# EAGLE design CoPro09 (EAGLE 7.7.0)

## Sheet 1 of 6: LOGIC
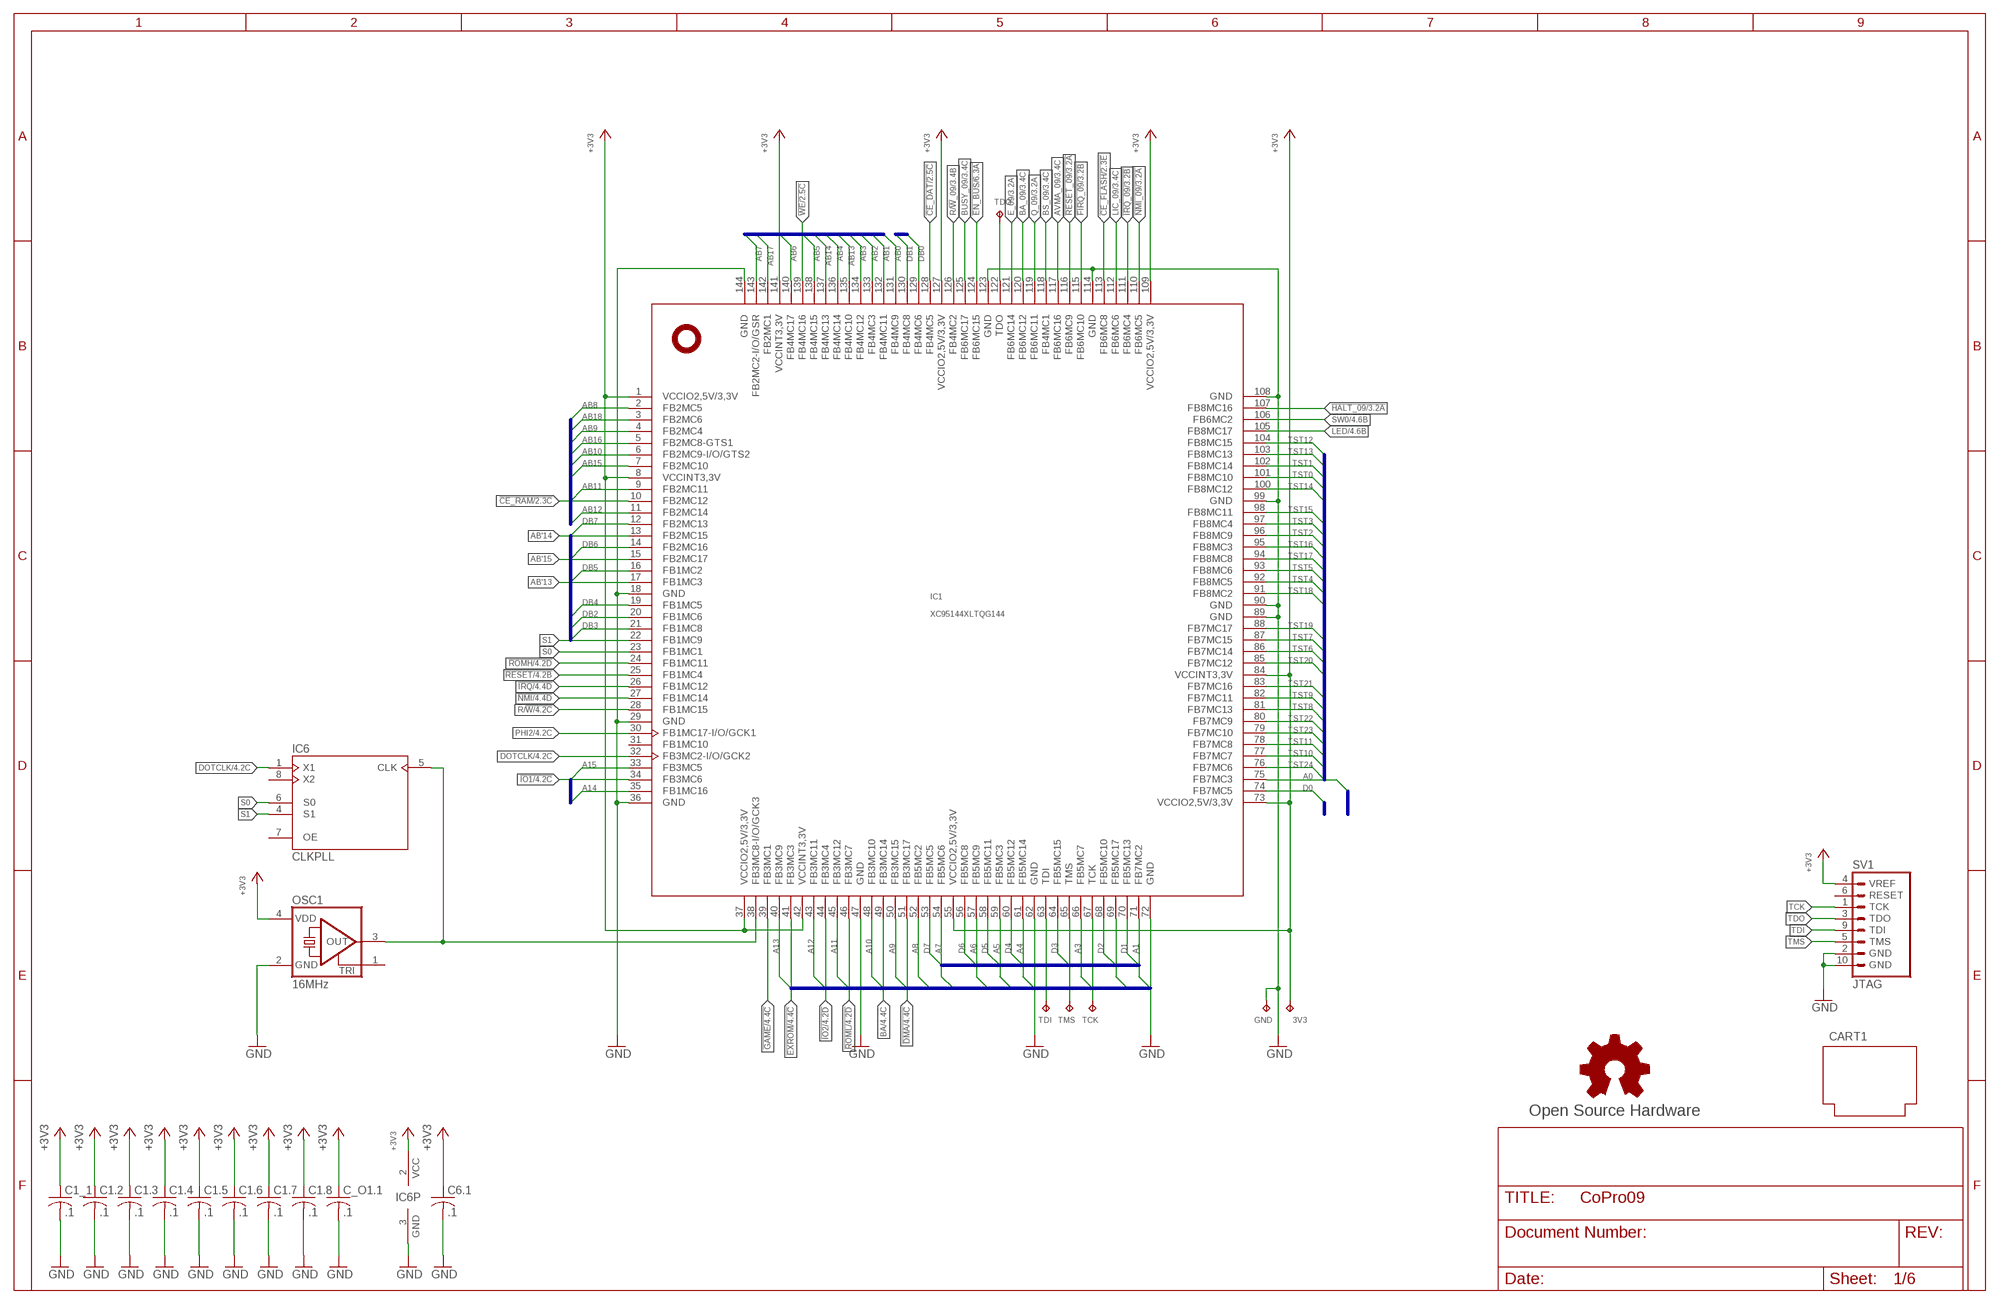
[diagram p0: schematic, sheet 1]

### Parts
3V3  TPTP08R  [TP08R]
C1.2  .1  C-USC0402  [C0402]
C1.3  .1  C-USC0402  [C0402]
C1.4  .1  C-USC0402  [C0402]
C1.5  .1  C-USC0402  [C0402]
C1.6  .1  C-USC0402  [C0402]
C1.7  .1  C-USC0402  [C0402]
C1.8  .1  C-USC0402  [C0402]
C1_1  .1  C-USC0402  [C0402]
C6.1  .1  C-USC0402  [C0402]
C_O1.1  .1  C-USC0402  [C0402]
CART1  CARTRIDGE_C64  [CARTRIDGE_C64]
GND  TPTP08R  [TP08R]
GOLD_ORB_SM1  Open Source Hardware  OSHWLOGOLOGO8MM  [OSHW_8MM]
IC1  XC95144XLTQG144  [TQFP144]
IC6  CLKPLL  [SOIC8]
OSC1  16MHz  ASE  [ASE]
SV1  JTAG  [JTAG]
TCK  TPTP08R  [TP08R]
TDI  TPTP08R  [TP08R]
TDO  TPTP08R  [TP08R]
TMS  TPTP08R  [TP08R]

### Nets
!CE_DAT: IC1.128(FB4MC5) ; also sheet 2
!CE_FLASH: IC1.113(FB6MC8) ; also sheet 2
!CE_RAM: IC1.10(FB2MC12) ; also sheet 2
!DMA: IC1.51(FB3MC17) ; also sheet 4
!EN_BUS: IC1.124(FB6MC15) ; also sheet 6
!EXROM: IC1.41(FB3MC3) ; also sheet 4
!FIRQ_09: IC1.115(FB6MC10) ; also sheet 3
!GAME: IC1.39(FB3MC1) ; also sheet 4
!HALT_09: IC1.107(FB8MC16) ; also sheet 3
!IO1: IC1.34(FB3MC6) ; also sheet 4
!IO2: IC1.44(FB3MC4) ; also sheet 4
!IRQ: IC1.26(FB1MC12) ; also sheet 4
!IRQ_09: IC1.111(FB6MC4) ; also sheet 3
!NMI: IC1.27(FB1MC14) ; also sheet 4
!NMI_09: IC1.110(FB6MC5) ; also sheet 3
!RESET: IC1.25(FB1MC4) ; also sheet 4
!RESET_09: IC1.116(FB6MC9) ; also sheet 3
!ROMH: IC1.24(FB1MC11) ; also sheet 4
!ROML: IC1.46(FB3MC7) ; also sheet 4
!WE: IC1.139(FB4MC16) ; also sheet 2
+3V3: 3V3.TP C1.2.1 C1.3.1 C1.4.1 C1.5.1 C1.6.1 C1.7.1 C1.8.1 C1_1.1 C6.1.1 C_O1.1.1 IC1.1(VCCIO2,5V/3,3V) IC1.8(VCCINT3,3V) IC1.37(VCCIO2,5V/3,3V) IC1.42(VCCINT3,3V) IC1.55(VCCIO2,5V/3,3V) IC1.73(VCCIO2,5V/3,3V) IC1.84(VCCINT3,3V) IC1.109(VCCIO2,5V/3,3V) IC1.127(VCCIO2,5V/3,3V) IC1.141(VCCINT3,3V) IC6.2(VCC) OSC1.4(VDD) SV1.4(VREF) ; also sheet 4,5
A0: IC1.75(FB7MC3) ; also sheet 4
A1: IC1.71(FB7MC2) ; also sheet 4
A2: IC1.69(FB5MC17) ; also sheet 4
A3: IC1.66(FB5MC7) ; also sheet 4
A4: IC1.61(FB5MC14) ; also sheet 4
A5: IC1.59(FB5MC3) ; also sheet 4
A6: IC1.57(FB5MC9) ; also sheet 4
A7: IC1.54(FB5MC6) ; also sheet 4
A8: IC1.52(FB5MC2) ; also sheet 4
A9: IC1.50(FB3MC15) ; also sheet 4
A10: IC1.48(FB3MC10) ; also sheet 4
A11: IC1.45(FB3MC12) ; also sheet 4
A12: IC1.43(FB3MC11) ; also sheet 4
A13: IC1.40(FB3MC9) ; also sheet 4
A14: IC1.35(FB1MC16) ; also sheet 4
A15: IC1.33(FB3MC5) ; also sheet 4
AB0: IC1.131(FB4MC9) ; also sheet 2,6
AB1: IC1.132(FB4MC11) ; also sheet 2,6
AB2: IC1.133(FB4MC3) ; also sheet 2,6
AB3: IC1.134(FB4MC12) ; also sheet 2,6
AB4: IC1.136(FB4MC14) ; also sheet 2,6
AB5: IC1.138(FB4MC15) ; also sheet 2,6
AB6: IC1.140(FB4MC17) ; also sheet 2,6
AB7: IC1.143(FB2MC2-I/O/GSR) ; also sheet 2,6
AB8: IC1.2(FB2MC5) ; also sheet 2,6
AB9: IC1.4(FB2MC4) ; also sheet 2,6
AB10: IC1.6(FB2MC9-I/O/GTS2) ; also sheet 2,6
AB11: IC1.9(FB2MC11) ; also sheet 2,6
AB12: IC1.11(FB2MC14) ; also sheet 2,6
AB13: IC1.135(FB4MC10) ; also sheet 2
AB14: IC1.137(FB4MC13) ; also sheet 2
AB15: IC1.7(FB2MC10) ; also sheet 2
AB16: IC1.5(FB2MC8-GTS1) ; also sheet 2
AB17: IC1.142(FB2MC1) ; also sheet 2
AB18: IC1.3(FB2MC6) ; also sheet 2
AB'13: IC1.17(FB1MC3) ; also sheet 3
AB'14: IC1.13(FB2MC15) ; also sheet 3
AB'15: IC1.15(FB2MC17) ; also sheet 3
AVMA_09: IC1.117(FB6MC16) ; also sheet 3
BA: IC1.49(FB3MC14) ; also sheet 4
BA_09: IC1.120(FB6MC12) ; also sheet 3
BS_09: IC1.118(FB4MC1) ; also sheet 3
BUSY_09: IC1.125(FB6MC17) ; also sheet 3
D0: IC1.74(FB7MC5) ; also sheet 4
D1: IC1.70(FB5MC13) ; also sheet 4
D2: IC1.68(FB5MC10) ; also sheet 4
D3: IC1.64(FB5MC15) ; also sheet 4
D4: IC1.60(FB5MC12) ; also sheet 4
D5: IC1.58(FB5MC11) ; also sheet 4
D6: IC1.56(FB5MC8) ; also sheet 4
D7: IC1.53(FB5MC5) ; also sheet 4
DB0: IC1.129(FB4MC6) ; also sheet 2,6
DB1: IC1.130(FB4MC8) ; also sheet 2,6
DB2: IC1.20(FB1MC6) ; also sheet 2,6
DB3: IC1.21(FB1MC8) ; also sheet 2,6
DB4: IC1.19(FB1MC5) ; also sheet 2,6
DB5: IC1.16(FB1MC2) ; also sheet 2,6
DB6: IC1.14(FB2MC16) ; also sheet 2,6
DB7: IC1.12(FB2MC13) ; also sheet 2,6
DOTCLK: IC1.32(FB3MC2-I/O/GCK2) IC6.1(X1) ; also sheet 4
E_09: IC1.121(FB6MC14) ; also sheet 3
GND: C1.2.2 C1.3.2 C1.4.2 C1.5.2 C1.6.2 C1.7.2 C1.8.2 C1_1.2 C6.1.2 C_O1.1.2 GND.TP IC1.18(GND) IC1.29(GND) IC1.36(GND) IC1.47(GND) IC1.62(GND) IC1.72(GND) IC1.89(GND) IC1.90(GND) IC1.99(GND) IC1.108(GND) IC1.114(GND) IC1.123(GND) IC1.144(GND) IC6.3(GND) OSC1.2(GND) SV1.2(GND) SV1.10(GND) ; also sheet 2,3,4,5,6
LED: IC1.105(FB8MC17) ; also sheet 4
LIC_09: IC1.112(FB6MC6) ; also sheet 3
N$4: IC1.38(FB3MC8-I/O/GCK3) IC6.5(CLK) OSC1.3(OUT)
PHI2: IC1.30(FB1MC17-I/O/GCK1) ; also sheet 4
Q_09: IC1.119(FB6MC11) ; also sheet 3
R/!W: IC1.28(FB1MC15) ; also sheet 4
R/!W!_09: IC1.126(FB4MC2) ; also sheet 3,6
S0: IC1.23(FB1MC1) IC6.6(S0)
S1: IC1.22(FB1MC9) IC6.4(S1)
SW0: IC1.106(FB6MC2) ; also sheet 4
TCK: IC1.67(TCK) SV1.1(TCK) TCK.TP
TDI: IC1.63(TDI) SV1.9(TDI) TDI.TP
TDO: IC1.122(TDO) SV1.3(TDO) TDO.TP
TMS: IC1.65(TMS) SV1.5(TMS) TMS.TP
TST0: IC1.101(FB8MC10) ; also sheet 4
TST1: IC1.102(FB8MC14) ; also sheet 4
TST2: IC1.96(FB8MC9) ; also sheet 4
TST3: IC1.97(FB8MC4) ; also sheet 4
TST4: IC1.92(FB8MC5) ; also sheet 4
TST5: IC1.93(FB8MC6) ; also sheet 4
TST6: IC1.86(FB7MC14) ; also sheet 4
TST7: IC1.87(FB7MC15) ; also sheet 4
TST8: IC1.81(FB7MC13) ; also sheet 4
TST9: IC1.82(FB7MC11) ; also sheet 4
TST10: IC1.77(FB7MC7) ; also sheet 4
TST11: IC1.78(FB7MC8) ; also sheet 4
TST12: IC1.104(FB8MC15) ; also sheet 4
TST13: IC1.103(FB8MC13) ; also sheet 4
TST14: IC1.100(FB8MC12) ; also sheet 4
TST15: IC1.98(FB8MC11) ; also sheet 4
TST16: IC1.95(FB8MC3) ; also sheet 4
TST17: IC1.94(FB8MC8) ; also sheet 4
TST18: IC1.91(FB8MC2) ; also sheet 4
TST19: IC1.88(FB7MC17) ; also sheet 4
TST20: IC1.85(FB7MC12) ; also sheet 4
TST21: IC1.83(FB7MC16) ; also sheet 4
TST22: IC1.80(FB7MC9) ; also sheet 4
TST23: IC1.79(FB7MC10) ; also sheet 4
TST24: IC1.76(FB7MC6) ; also sheet 4
Unconnected: IC1.31(FB1MC10) IC6.7(OE) IC6.8(X2) OSC1.1(TRI) SV1.6(RESET)

### Buses
D[0..7]
A[0..15]
AB[0..18]
DB[0..7]
TST[0..24]

## Sheet 2 of 6: MEMORY
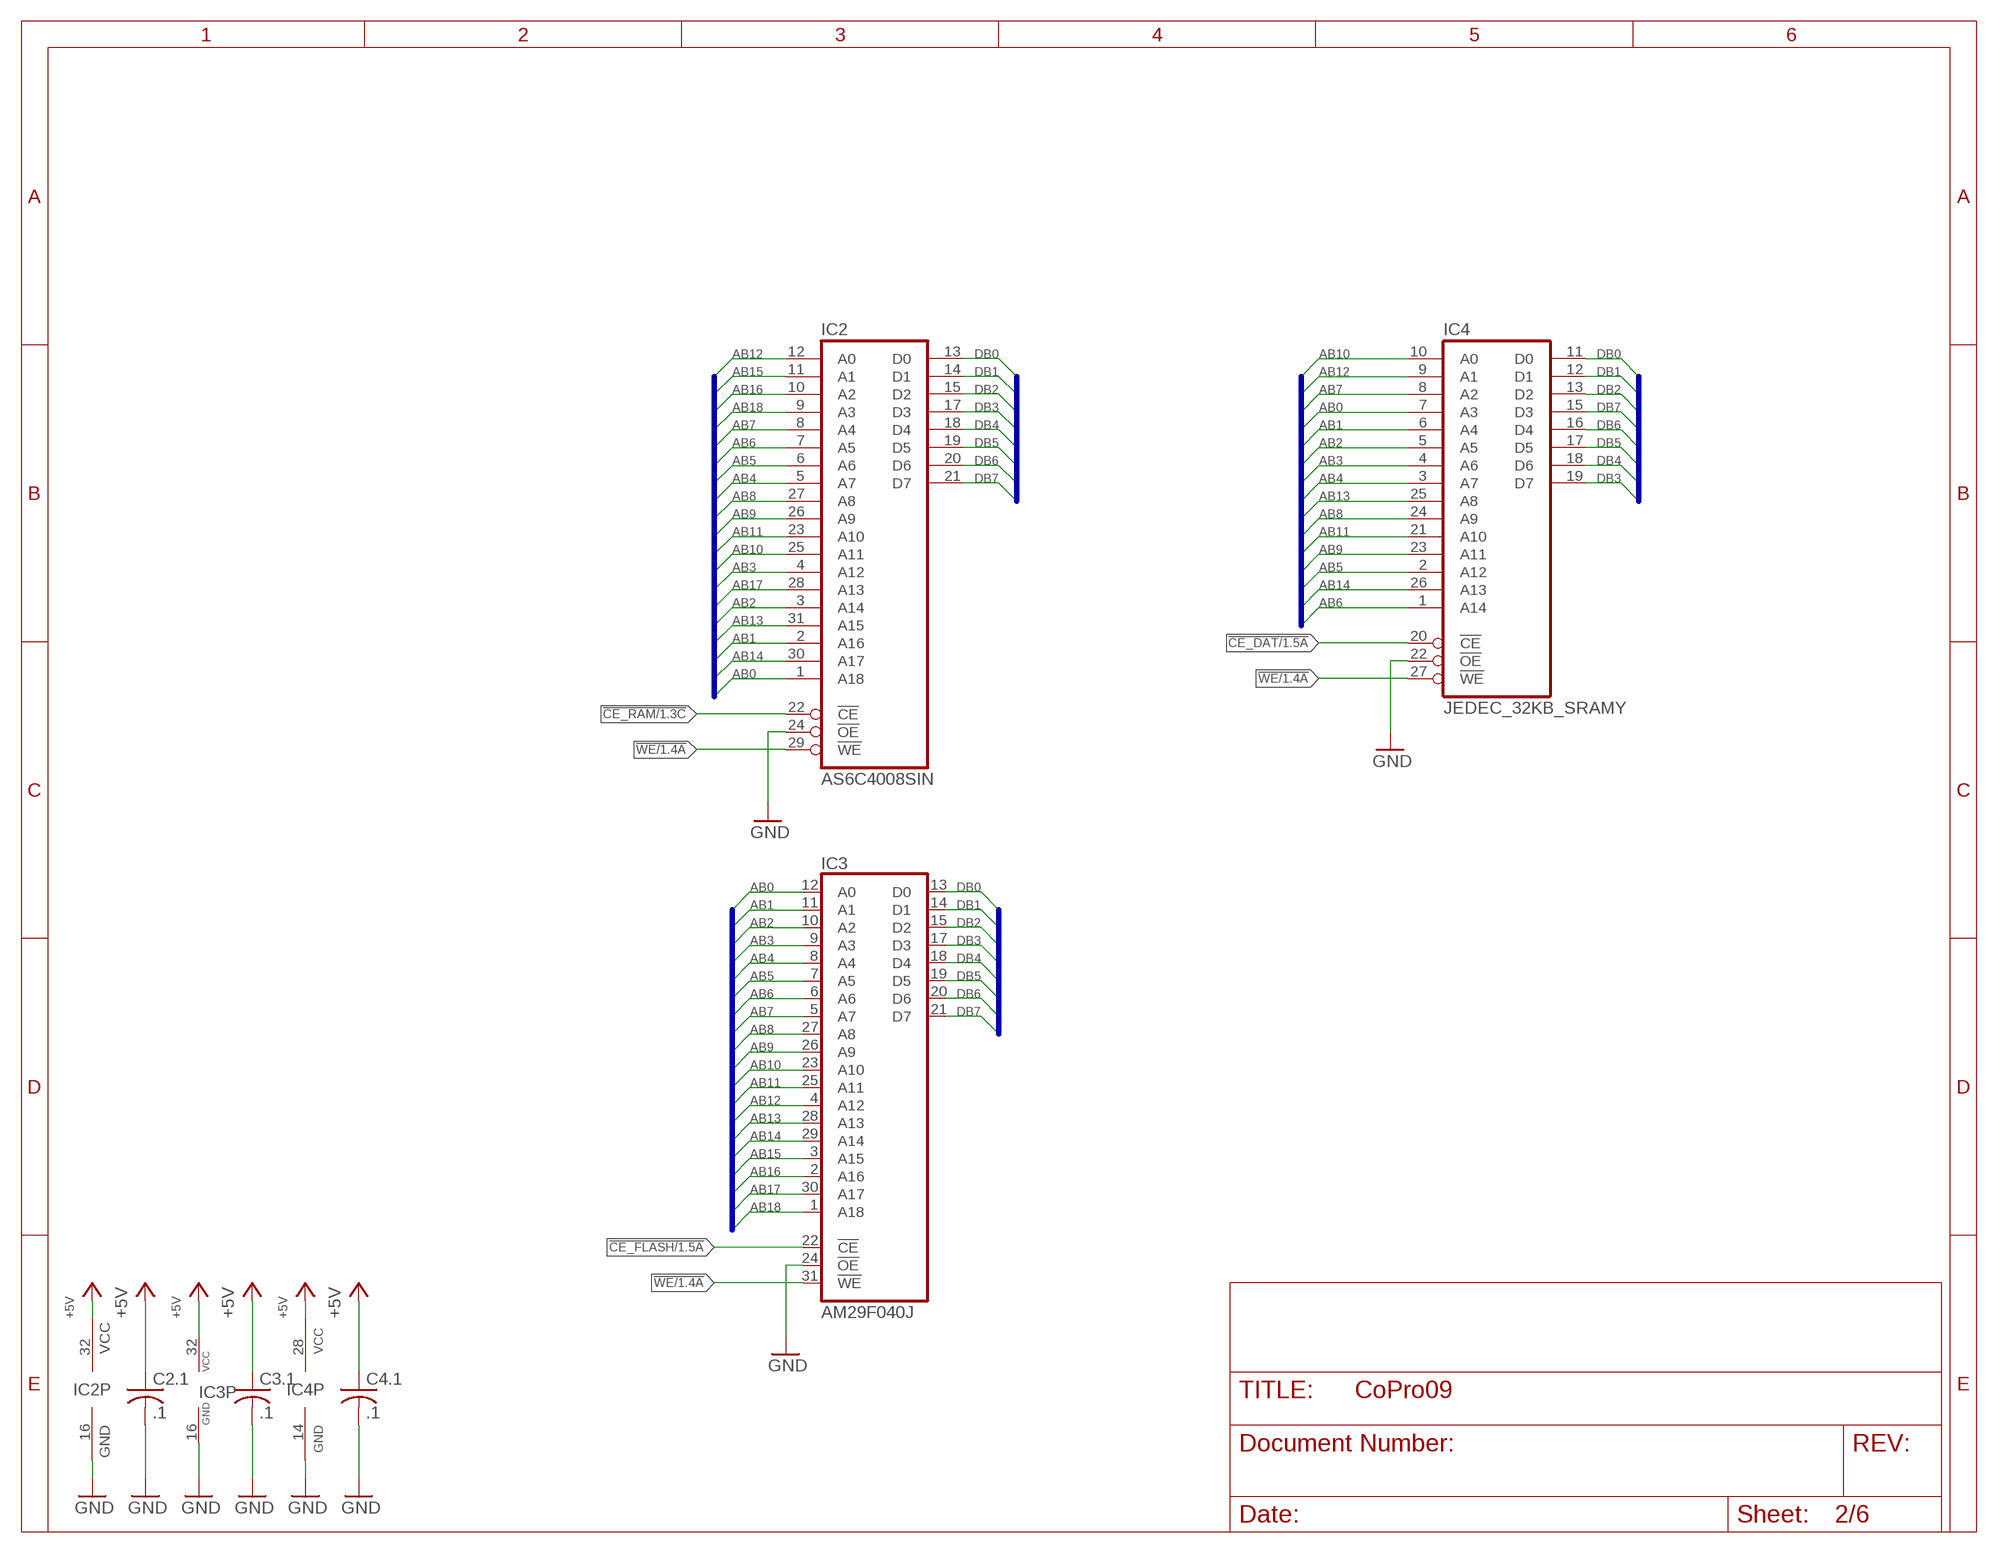
[diagram p1: schematic, sheet 2]

### Parts
C2.1  .1  C-USC0402  [C0402]
C3.1  .1  C-USC0402  [C0402]
C4.1  .1  C-USC0402  [C0402]
IC2  AS6C4008SIN  [SOP32L]
IC3  AM29F040J  [PLCC32R]
IC4  JEDEC_32KB_SRAMY  [SOJ32/3]

### Nets
!CE_DAT: IC4.20(!CE) ; also sheet 1
!CE_FLASH: IC3.22(!CE) ; also sheet 1
!CE_RAM: IC2.22(!CE) ; also sheet 1
!WE: IC2.29(!WE) IC3.31(!WE) IC4.27(!WE) ; also sheet 1
+5V: C2.1.1 C3.1.1 C4.1.1 IC2.32(VCC) IC3.32(VCC) IC4.28(VCC) ; also sheet 3,4,5,6
AB0: IC2.1(A18) IC3.12(A0) IC4.7(A3) ; also sheet 1,6
AB1: IC2.2(A16) IC3.11(A1) IC4.6(A4) ; also sheet 1,6
AB2: IC2.3(A14) IC3.10(A2) IC4.5(A5) ; also sheet 1,6
AB3: IC2.4(A12) IC3.9(A3) IC4.4(A6) ; also sheet 1,6
AB4: IC2.5(A7) IC3.8(A4) IC4.3(A7) ; also sheet 1,6
AB5: IC2.6(A6) IC3.7(A5) IC4.2(A12) ; also sheet 1,6
AB6: IC2.7(A5) IC3.6(A6) IC4.1(A14) ; also sheet 1,6
AB7: IC2.8(A4) IC3.5(A7) IC4.8(A2) ; also sheet 1,6
AB8: IC2.27(A8) IC3.27(A8) IC4.24(A9) ; also sheet 1,6
AB9: IC2.26(A9) IC3.26(A9) IC4.23(A11) ; also sheet 1,6
AB10: IC2.25(A11) IC3.23(A10) IC4.10(A0) ; also sheet 1,6
AB11: IC2.23(A10) IC3.25(A11) IC4.21(A10) ; also sheet 1,6
AB12: IC2.12(A0) IC3.4(A12) IC4.9(A1) ; also sheet 1,6
AB13: IC2.31(A15) IC3.28(A13) IC4.25(A8) ; also sheet 1
AB14: IC2.30(A17) IC3.29(A14) IC4.26(A13) ; also sheet 1
AB15: IC2.11(A1) IC3.3(A15) ; also sheet 1
AB16: IC2.10(A2) IC3.2(A16) ; also sheet 1
AB17: IC2.28(A13) IC3.30(A17) ; also sheet 1
AB18: IC2.9(A3) IC3.1(A18) ; also sheet 1
DB0: IC2.13(D0) IC3.13(D0) IC4.11(D0) ; also sheet 1,6
DB1: IC2.14(D1) IC3.14(D1) IC4.12(D1) ; also sheet 1,6
DB2: IC2.15(D2) IC3.15(D2) IC4.13(D2) ; also sheet 1,6
DB3: IC2.17(D3) IC3.17(D3) IC4.19(D7) ; also sheet 1,6
DB4: IC2.18(D4) IC3.18(D4) IC4.18(D6) ; also sheet 1,6
DB5: IC2.19(D5) IC3.19(D5) IC4.17(D5) ; also sheet 1,6
DB6: IC2.20(D6) IC3.20(D6) IC4.16(D4) ; also sheet 1,6
DB7: IC2.21(D7) IC3.21(D7) IC4.15(D3) ; also sheet 1,6
GND: C2.1.2 C3.1.2 C4.1.2 IC2.16(GND) IC2.24(!OE) IC3.16(GND) IC3.24(!OE) IC4.14(GND) IC4.22(!OE) ; also sheet 1,3,4,5,6

### Buses
AB[0..18]
DB[0..7]

## Sheet 3 of 6: CPU
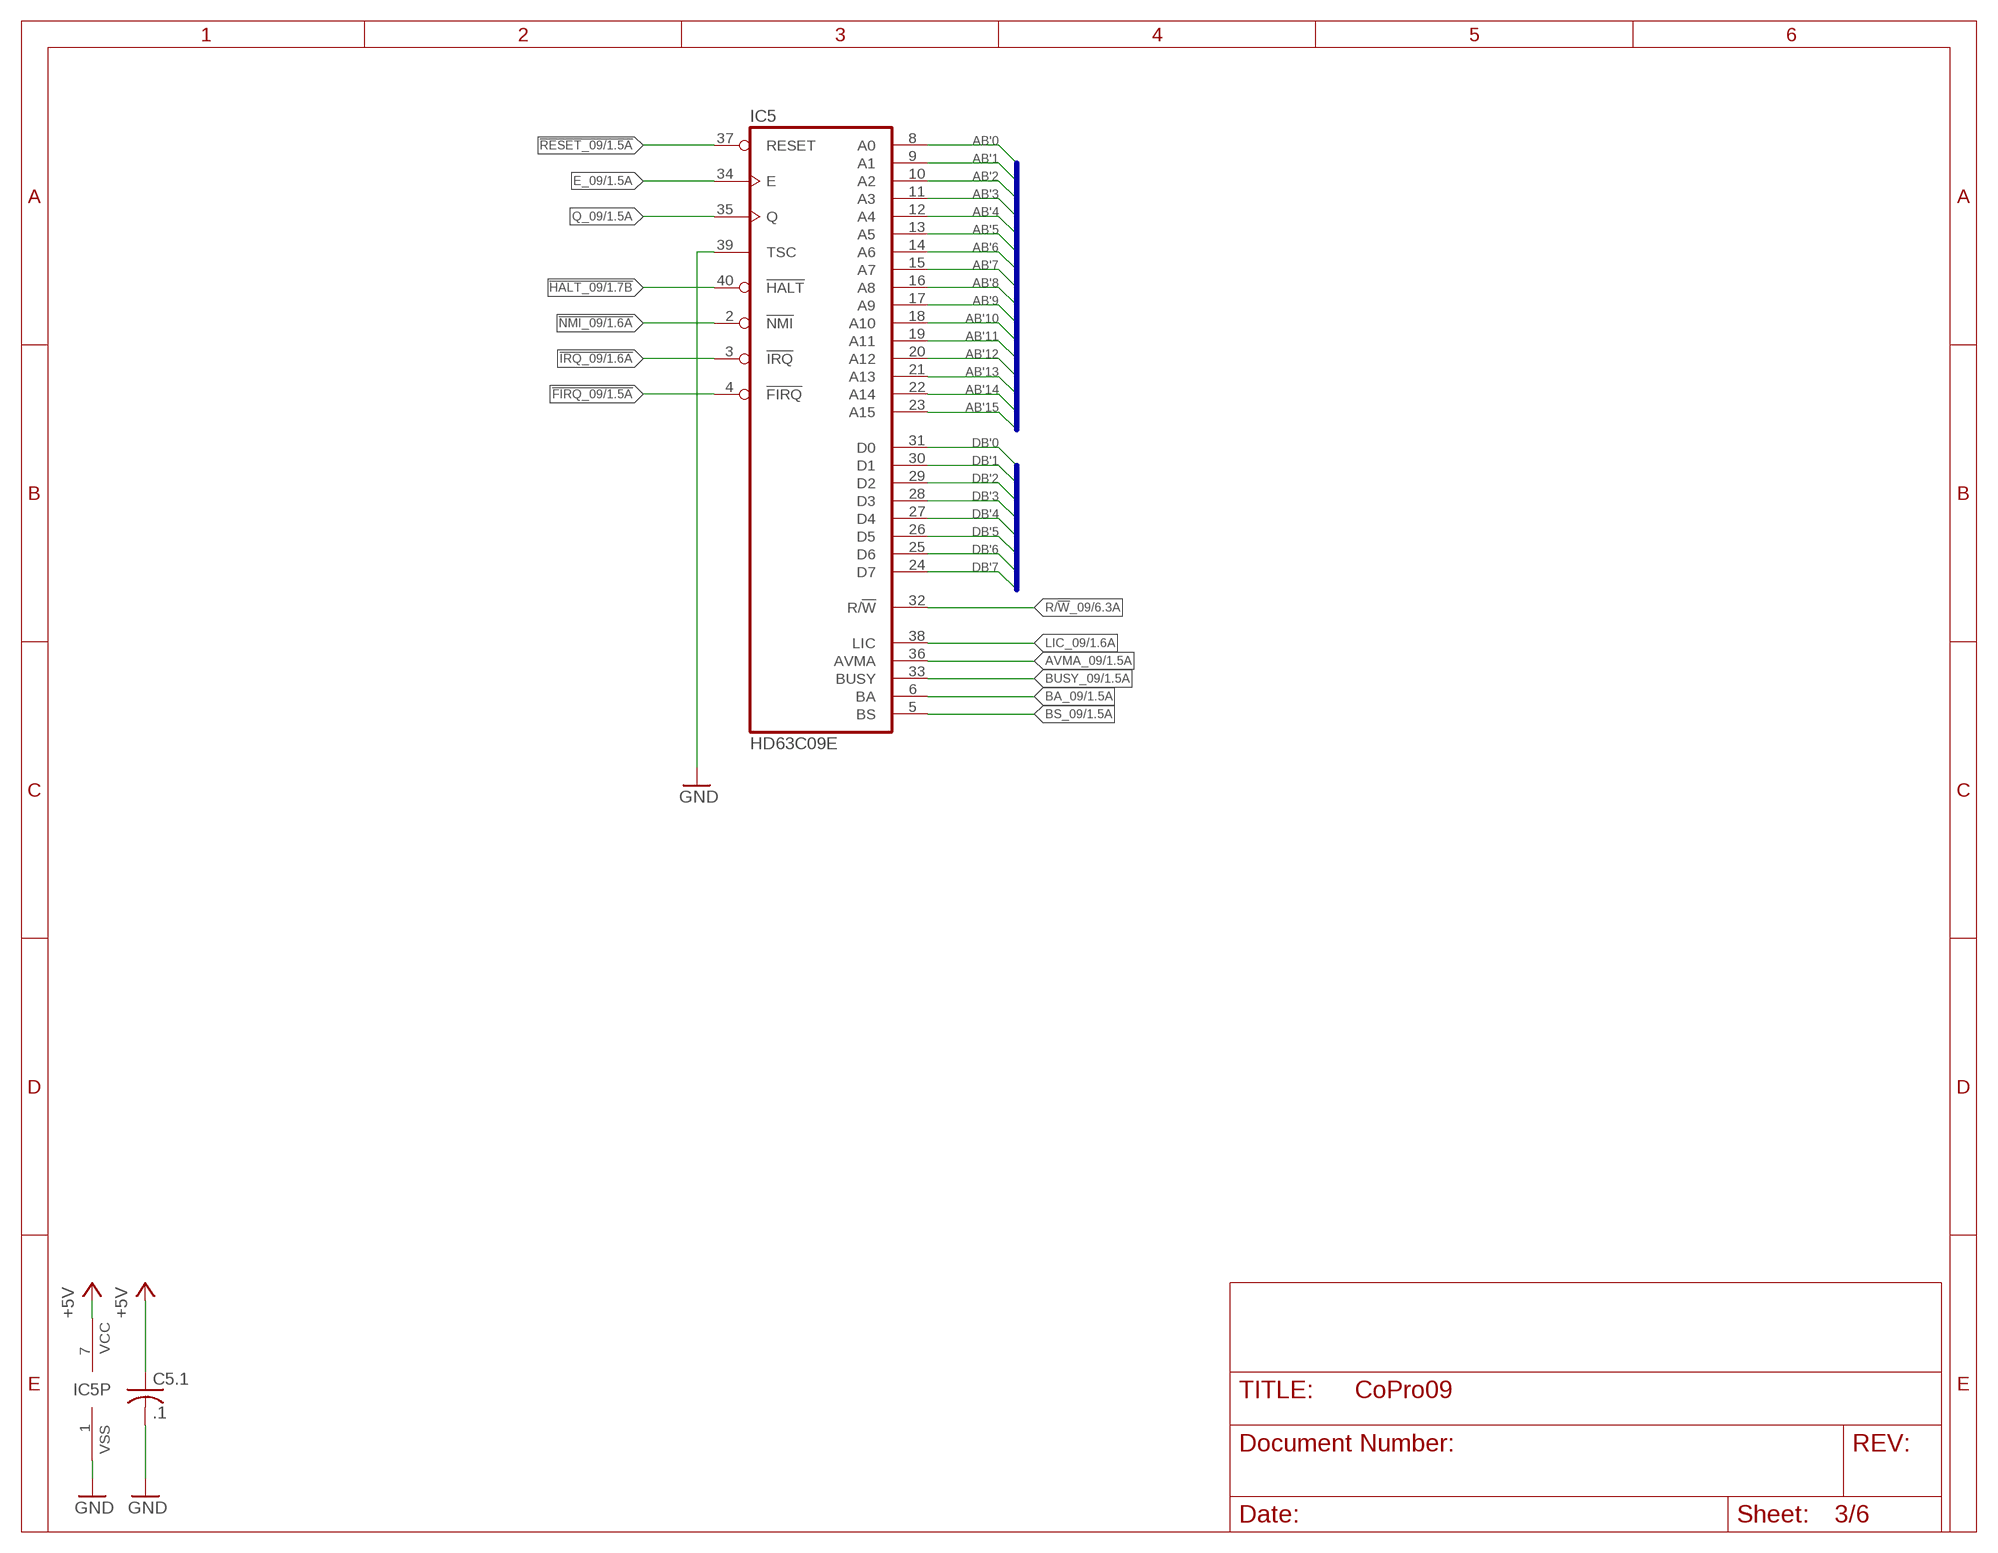
[diagram p2: schematic, sheet 3]

### Parts
C5.1  .1  C-USC0402  [C0402]
IC5  HD63C09E  6809ER  [DIL40-ROUNDPAD]

### Nets
!FIRQ_09: IC5.4(!FIRQ) ; also sheet 1
!HALT_09: IC5.40(!HALT) ; also sheet 1
!IRQ_09: IC5.3(!IRQ) ; also sheet 1
!NMI_09: IC5.2(!NMI) ; also sheet 1
!RESET_09: IC5.37(RESET) ; also sheet 1
+5V: C5.1.1 IC5.7(VCC) ; also sheet 2,4,5,6
AB'0: IC5.8(A0) ; also sheet 6
AB'1: IC5.9(A1) ; also sheet 6
AB'2: IC5.10(A2) ; also sheet 6
AB'3: IC5.11(A3) ; also sheet 6
AB'4: IC5.12(A4) ; also sheet 6
AB'5: IC5.13(A5) ; also sheet 6
AB'6: IC5.14(A6) ; also sheet 6
AB'7: IC5.15(A7) ; also sheet 6
AB'8: IC5.16(A8) ; also sheet 6
AB'9: IC5.17(A9) ; also sheet 6
AB'10: IC5.18(A10) ; also sheet 6
AB'11: IC5.19(A11) ; also sheet 6
AB'12: IC5.20(A12) ; also sheet 6
AB'13: IC5.21(A13) ; also sheet 1
AB'14: IC5.22(A14) ; also sheet 1
AB'15: IC5.23(A15) ; also sheet 1
AVMA_09: IC5.36(AVMA) ; also sheet 1
BA_09: IC5.6(BA) ; also sheet 1
BS_09: IC5.5(BS) ; also sheet 1
BUSY_09: IC5.33(BUSY) ; also sheet 1
DB'0: IC5.31(D0) ; also sheet 6
DB'1: IC5.30(D1) ; also sheet 6
DB'2: IC5.29(D2) ; also sheet 6
DB'3: IC5.28(D3) ; also sheet 6
DB'4: IC5.27(D4) ; also sheet 6
DB'5: IC5.26(D5) ; also sheet 6
DB'6: IC5.25(D6) ; also sheet 6
DB'7: IC5.24(D7) ; also sheet 6
E_09: IC5.34(E) ; also sheet 1
GND: C5.1.2 IC5.1(VSS) IC5.39(TSC) ; also sheet 1,2,4,5,6
LIC_09: IC5.38(LIC) ; also sheet 1
Q_09: IC5.35(Q) ; also sheet 1
R/!W!_09: IC5.32(R/!W) ; also sheet 1,6

### Buses
AB'[0..15]
DB'[0..7]

## Sheet 4 of 6: IO
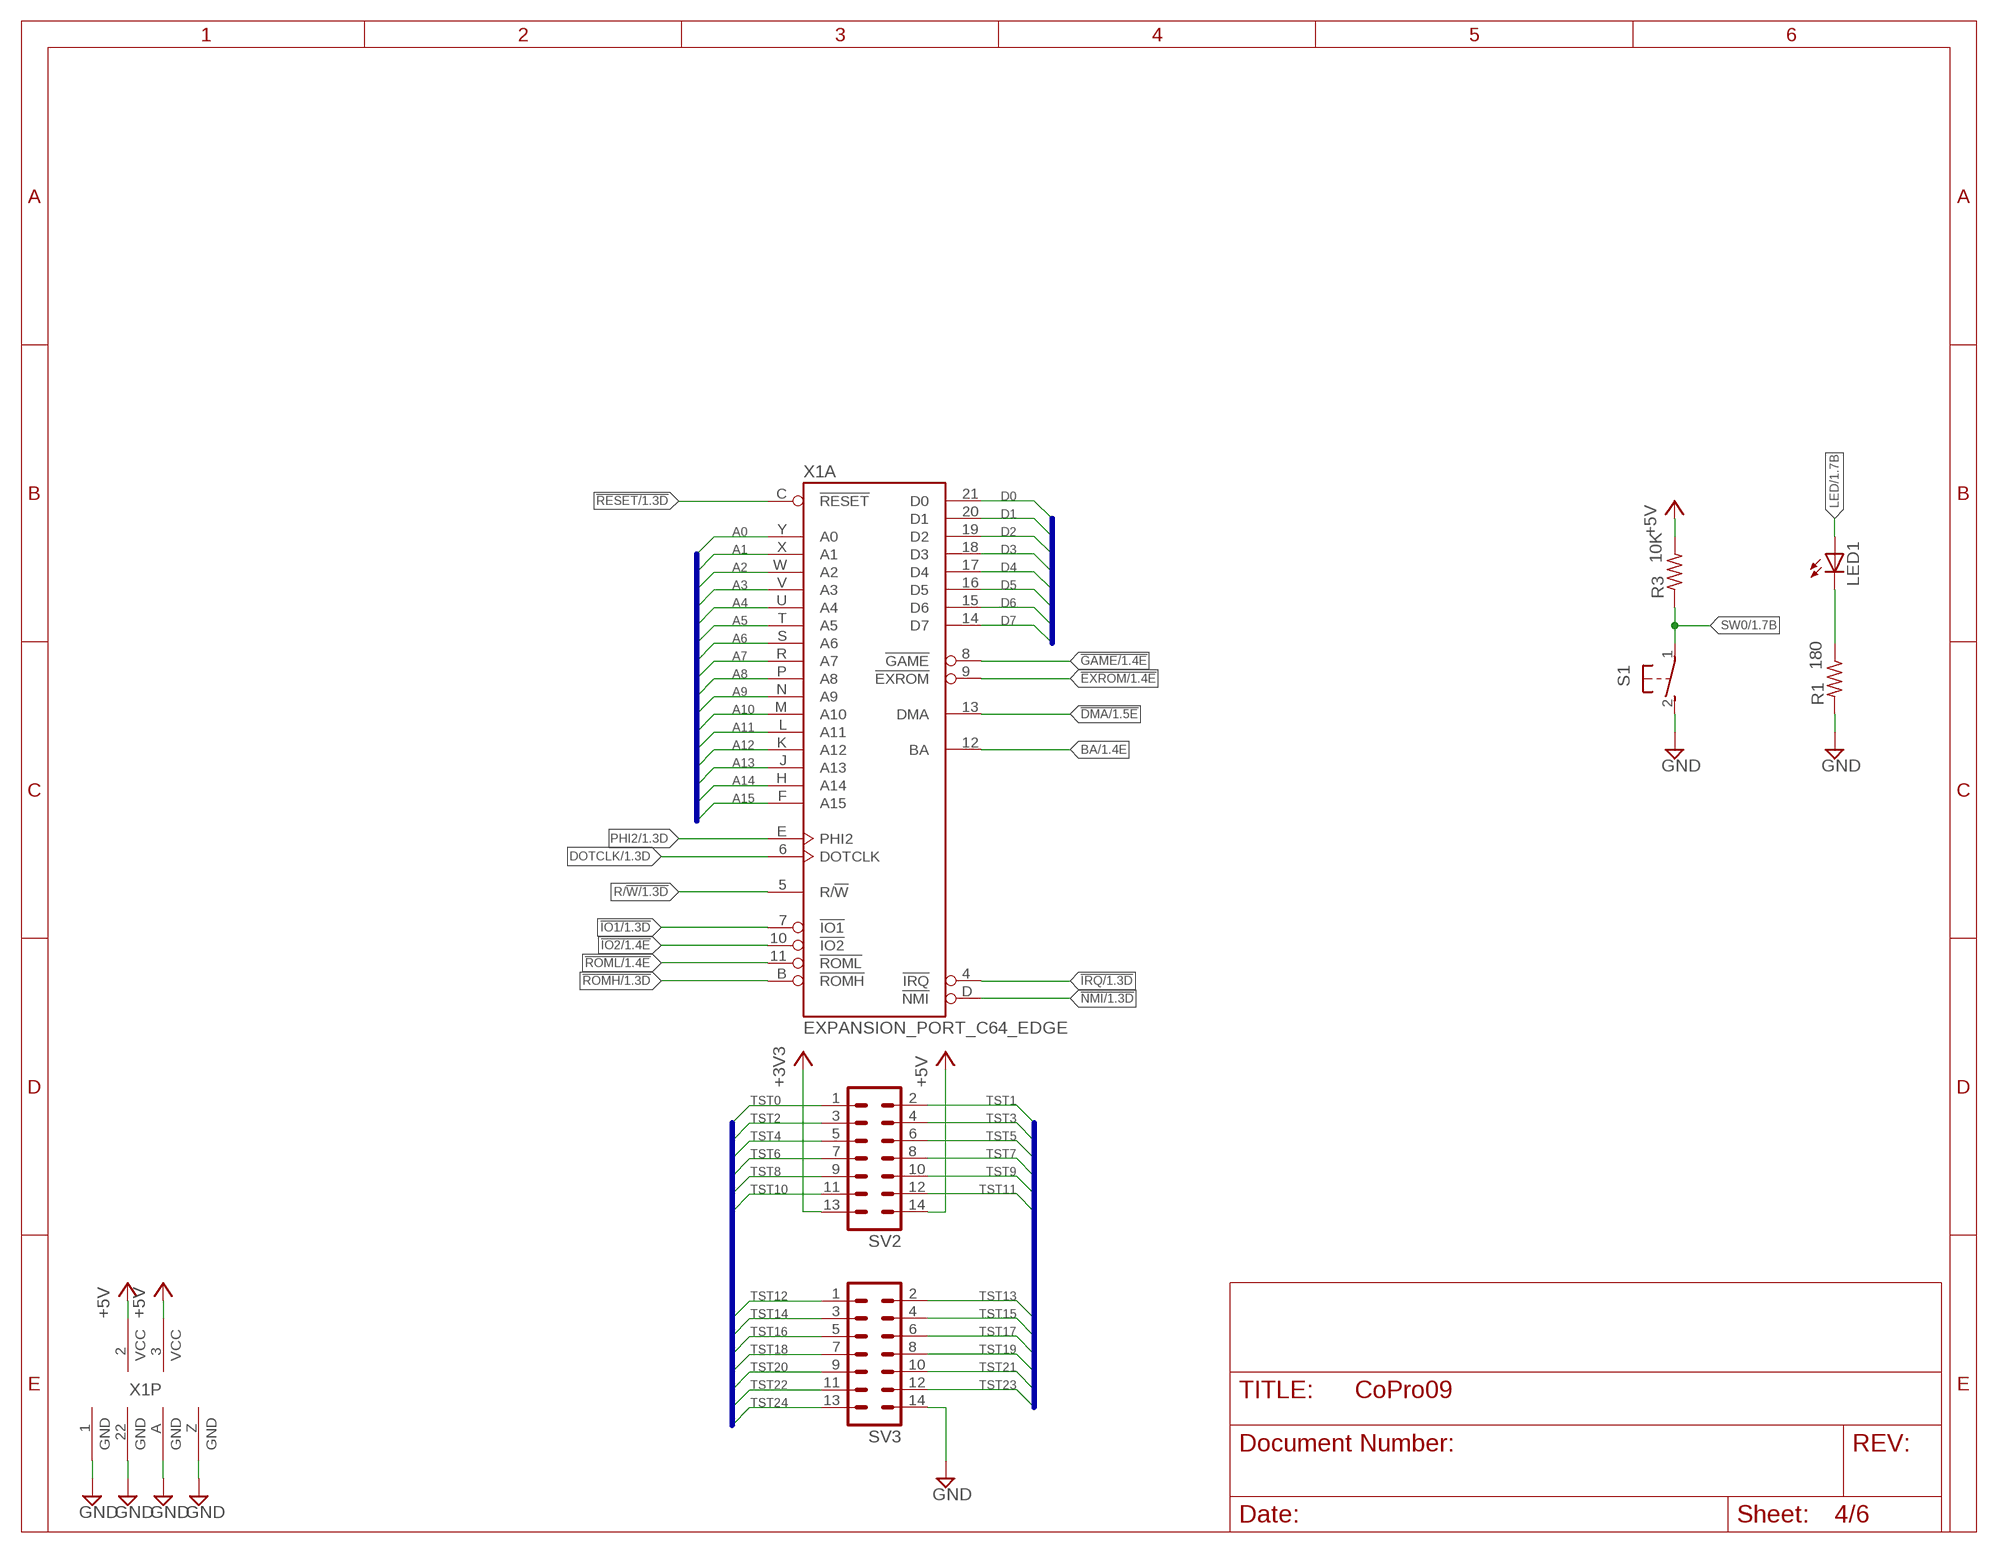
[diagram p3: schematic, sheet 4]

### Parts
LED1  LED3MM  [LED3MM]
R1  180  R-US_R0402  [R0402]
R3  10K  R-US_R0402  [R0402]
S1  31-XX  [B3F-31XX]
SV2  MA07-2  [MA07-2]
SV3  MA07-2  [MA07-2]
X1  EXPANSION_PORT_C64_EDGE  [MA100-22-2]

### Nets
!DMA: X1.13(A:DMA) ; also sheet 1
!EXROM: X1.9(A:!EXROM) ; also sheet 1
!GAME: X1.8(A:!GAME) ; also sheet 1
!IO1: X1.7(A:!IO1) ; also sheet 1
!IO2: X1.10(A:!IO2) ; also sheet 1
!IRQ: X1.4(A:!IRQ) ; also sheet 1
!NMI: X1.D(A:!NMI) ; also sheet 1
!RESET: X1.C(A:!RESET) ; also sheet 1
!ROMH: X1.B(A:!ROMH) ; also sheet 1
!ROML: X1.11(A:!ROML) ; also sheet 1
+3V3: SV2.13 ; also sheet 1,5
+5V: R3.2 SV2.14 X1.2(P:VCC) X1.3(P:VCC) ; also sheet 2,3,5,6
A0: X1.Y(A:A0) ; also sheet 1
A1: X1.X(A:A1) ; also sheet 1
A2: X1.W(A:A2) ; also sheet 1
A3: X1.V(A:A3) ; also sheet 1
A4: X1.U(A:A4) ; also sheet 1
A5: X1.T(A:A5) ; also sheet 1
A6: X1.S(A:A6) ; also sheet 1
A7: X1.R(A:A7) ; also sheet 1
A8: X1.P(A:A8) ; also sheet 1
A9: X1.N(A:A9) ; also sheet 1
A10: X1.M(A:A10) ; also sheet 1
A11: X1.L(A:A11) ; also sheet 1
A12: X1.K(A:A12) ; also sheet 1
A13: X1.J(A:A13) ; also sheet 1
A14: X1.H(A:A14) ; also sheet 1
A15: X1.F(A:A15) ; also sheet 1
BA: X1.12(A:BA) ; also sheet 1
D0: X1.21(A:D0) ; also sheet 1
D1: X1.20(A:D1) ; also sheet 1
D2: X1.19(A:D2) ; also sheet 1
D3: X1.18(A:D3) ; also sheet 1
D4: X1.17(A:D4) ; also sheet 1
D5: X1.16(A:D5) ; also sheet 1
D6: X1.15(A:D6) ; also sheet 1
D7: X1.14(A:D7) ; also sheet 1
DOTCLK: X1.6(A:DOTCLK) ; also sheet 1
GND: R1.2 S1.2(S) SV3.14 X1.1(P:GND) X1.22(P:GND) X1.A(P:GND) X1.Z(P:GND) ; also sheet 1,2,3,5,6
LED: LED1.A ; also sheet 1
N$1: LED1.K(C) R1.1
PHI2: X1.E(A:PHI2) ; also sheet 1
R/!W: X1.5(A:R/!W) ; also sheet 1
SW0: R3.1 S1.1(P) ; also sheet 1
TST0: SV2.1 ; also sheet 1
TST1: SV2.2 ; also sheet 1
TST2: SV2.3 ; also sheet 1
TST3: SV2.4 ; also sheet 1
TST4: SV2.5 ; also sheet 1
TST5: SV2.6 ; also sheet 1
TST6: SV2.7 ; also sheet 1
TST7: SV2.8 ; also sheet 1
TST8: SV2.9 ; also sheet 1
TST9: SV2.10 ; also sheet 1
TST10: SV2.11 ; also sheet 1
TST11: SV2.12 ; also sheet 1
TST12: SV3.1 ; also sheet 1
TST13: SV3.2 ; also sheet 1
TST14: SV3.3 ; also sheet 1
TST15: SV3.4 ; also sheet 1
TST16: SV3.5 ; also sheet 1
TST17: SV3.6 ; also sheet 1
TST18: SV3.7 ; also sheet 1
TST19: SV3.8 ; also sheet 1
TST20: SV3.9 ; also sheet 1
TST21: SV3.10 ; also sheet 1
TST22: SV3.11 ; also sheet 1
TST23: SV3.12 ; also sheet 1
TST24: SV3.13 ; also sheet 1

### Buses
A[0..15]
D[0..7]
TST[0..24]

## Sheet 5 of 6: POWER
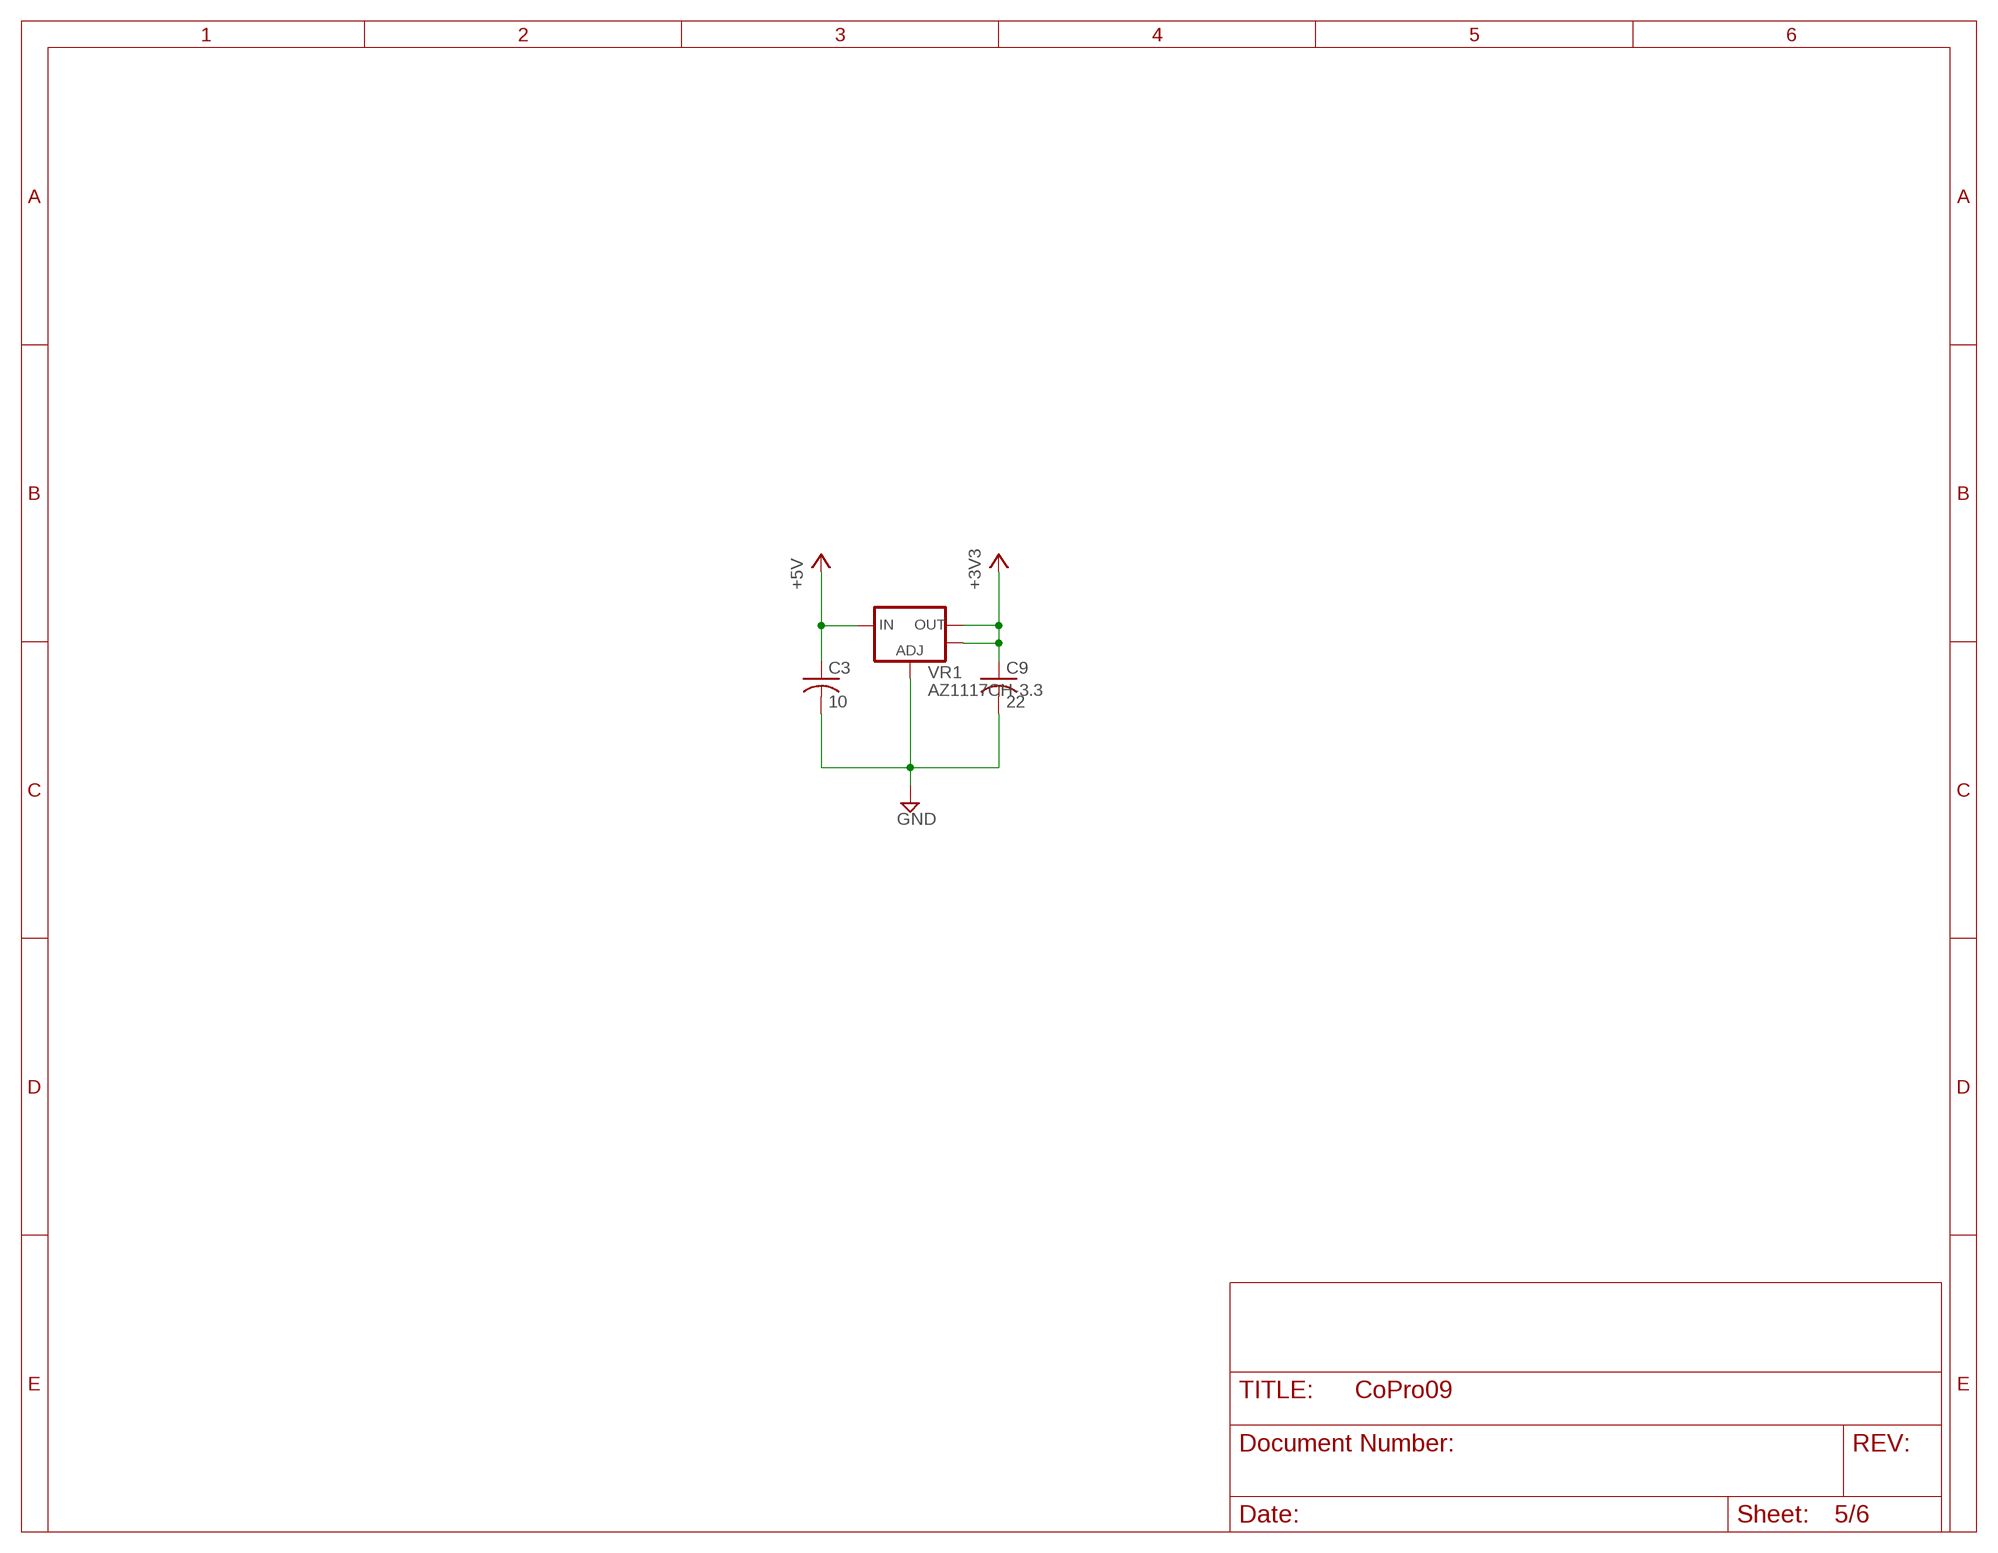
[diagram p4: schematic, sheet 5]

### Parts
C3  10  C-USC0805  [C0805]
C9  22  C-USC0805  [C0805]
VR1  AZ1117CH-3.3  V_REG_LM1117SOT223  [SOT223]

### Nets
+3V3: C9.1 VR1.2(OUT) VR1.4(OUT) ; also sheet 1,4
+5V: C3.1 VR1.3(IN) ; also sheet 2,3,4,6
GND: C3.2 C9.2 VR1.1(ADJ) ; also sheet 1,2,3,4,6

## Sheet 6 of 6
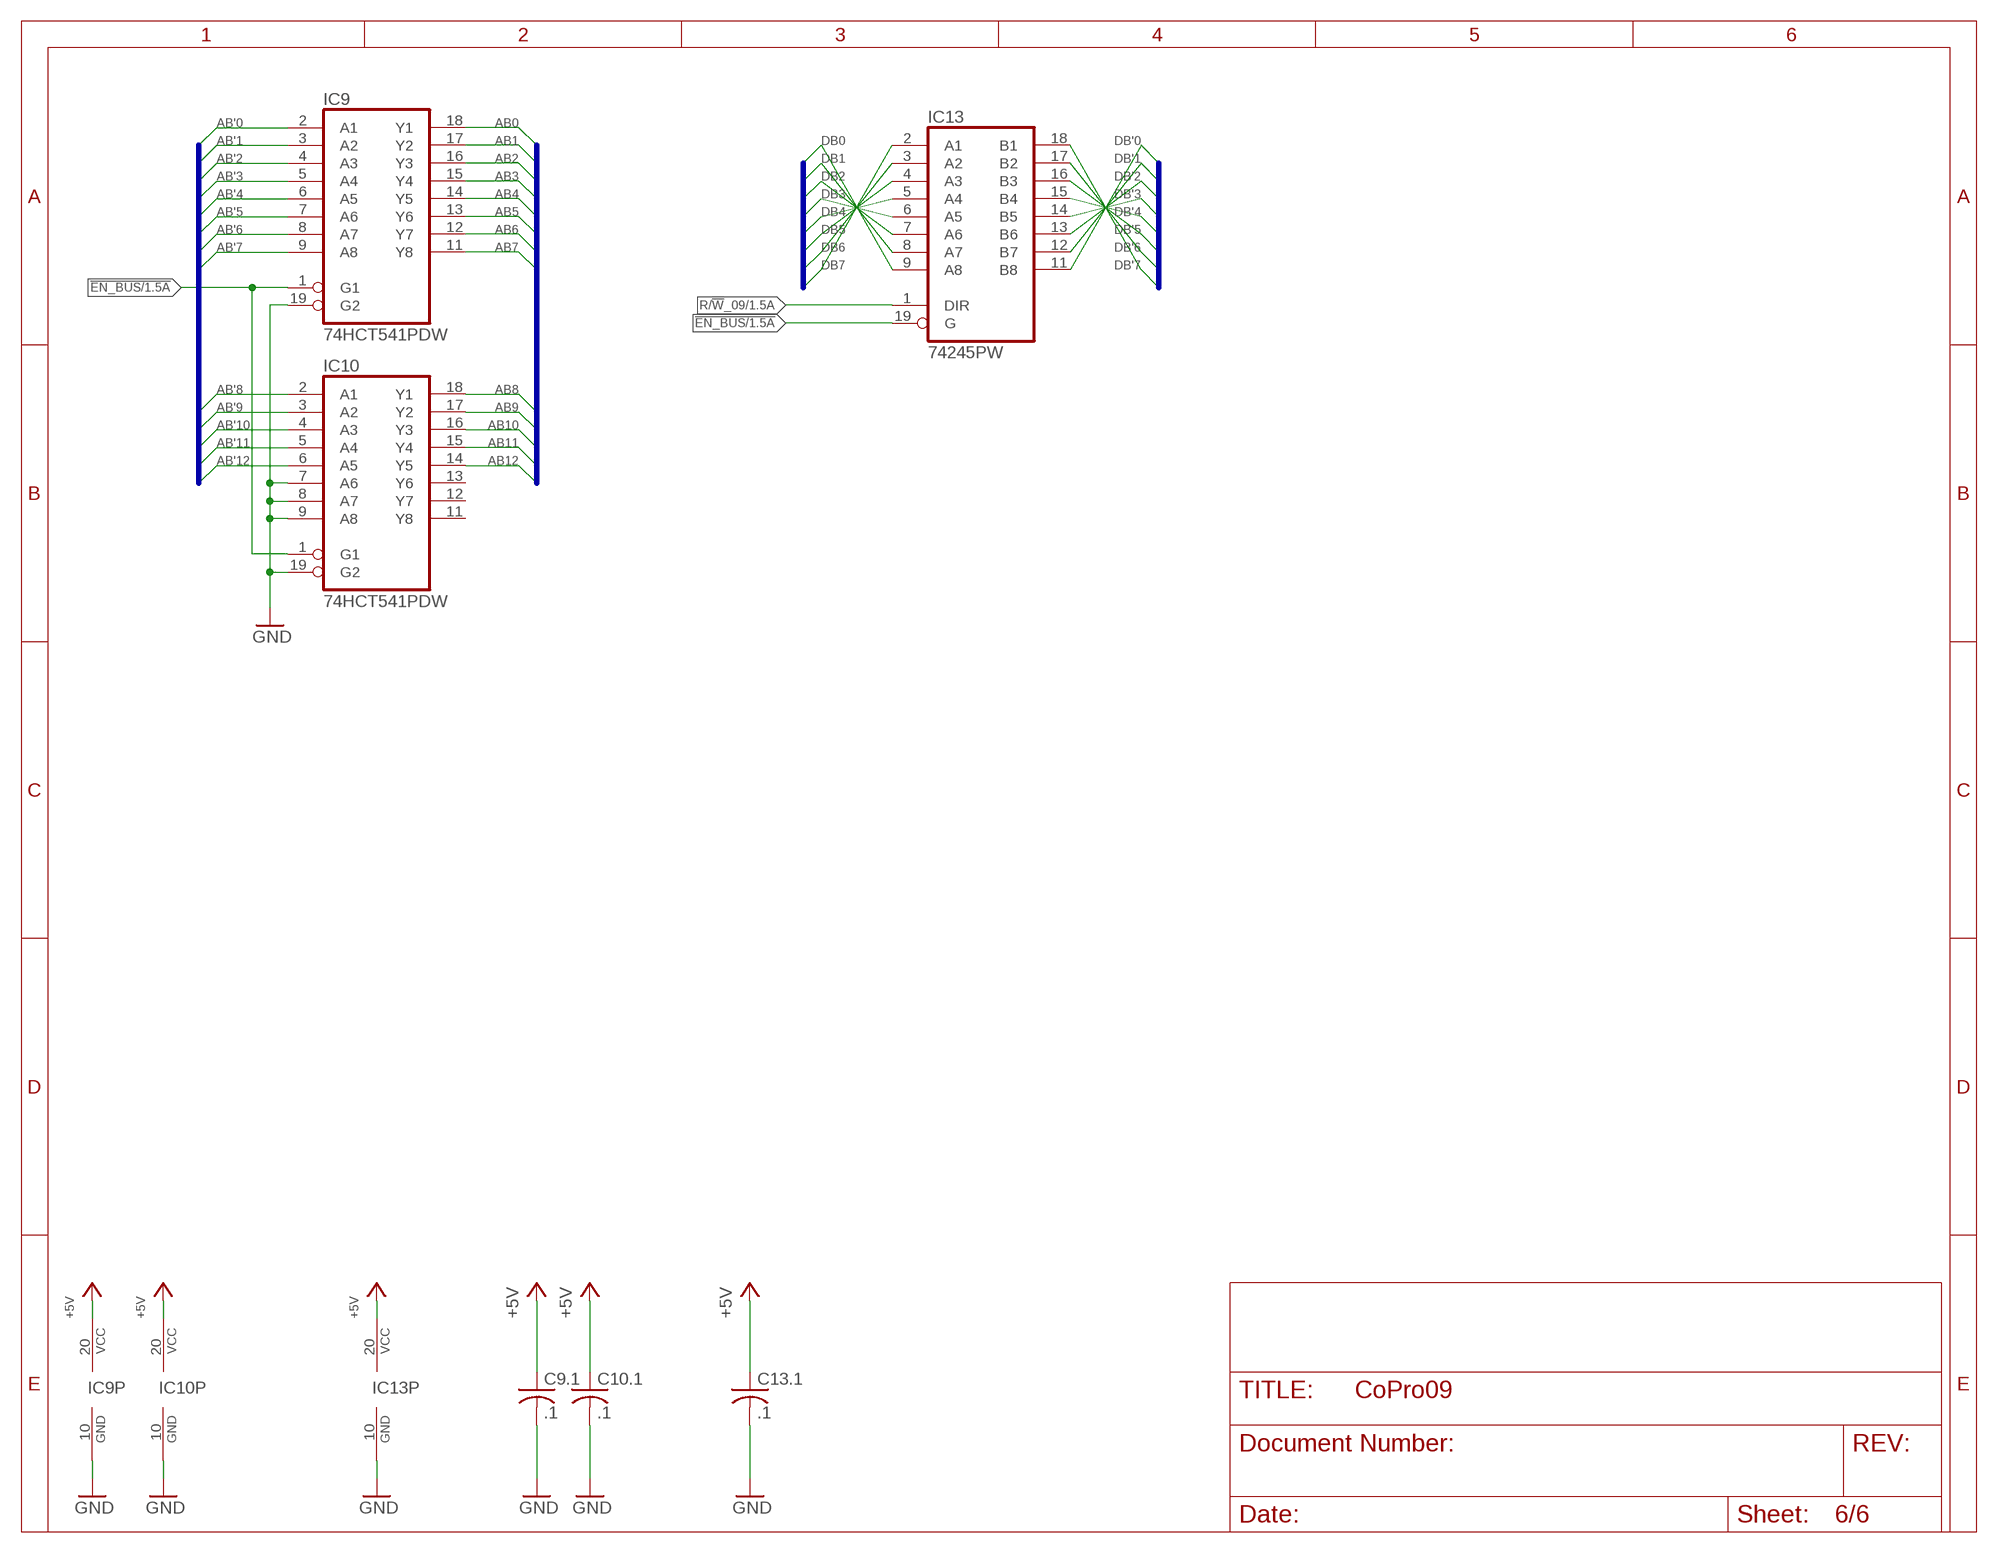
[diagram p5: schematic, sheet 6]

### Parts
C9.1  .1  C-USC0402  [C0402]
C10.1  .1  C-USC0402  [C0402]
C13.1  .1  C-USC0402  [C0402]
IC9  74HCT541PDW  [TSSOP20]
IC10  74HCT541PDW  [TSSOP20]
IC13  74245PW  [TSSOP20]

### Nets
!EN_BUS: IC9.1(G1) IC10.1(G1) IC13.19(G) ; also sheet 1
+5V: C9.1.1 C10.1.1 C13.1.1 IC9.20(VCC) IC10.20(VCC) IC13.20(VCC) ; also sheet 2,3,4,5
AB0: IC9.18(Y1) ; also sheet 1,2
AB1: IC9.17(Y2) ; also sheet 1,2
AB2: IC9.16(Y3) ; also sheet 1,2
AB3: IC9.15(Y4) ; also sheet 1,2
AB4: IC9.14(Y5) ; also sheet 1,2
AB5: IC9.13(Y6) ; also sheet 1,2
AB6: IC9.12(Y7) ; also sheet 1,2
AB7: IC9.11(Y8) ; also sheet 1,2
AB8: IC10.18(Y1) ; also sheet 1,2
AB9: IC10.17(Y2) ; also sheet 1,2
AB10: IC10.16(Y3) ; also sheet 1,2
AB11: IC10.15(Y4) ; also sheet 1,2
AB12: IC10.14(Y5) ; also sheet 1,2
AB'0: IC9.2(A1) ; also sheet 3
AB'1: IC9.3(A2) ; also sheet 3
AB'2: IC9.4(A3) ; also sheet 3
AB'3: IC9.5(A4) ; also sheet 3
AB'4: IC9.6(A5) ; also sheet 3
AB'5: IC9.7(A6) ; also sheet 3
AB'6: IC9.8(A7) ; also sheet 3
AB'7: IC9.9(A8) ; also sheet 3
AB'8: IC10.2(A1) ; also sheet 3
AB'9: IC10.3(A2) ; also sheet 3
AB'10: IC10.4(A3) ; also sheet 3
AB'11: IC10.5(A4) ; also sheet 3
AB'12: IC10.6(A5) ; also sheet 3
DB0: IC13.9(A8) ; also sheet 1,2
DB1: IC13.8(A7) ; also sheet 1,2
DB2: IC13.7(A6) ; also sheet 1,2
DB3: IC13.6(A5) ; also sheet 1,2
DB4: IC13.5(A4) ; also sheet 1,2
DB5: IC13.4(A3) ; also sheet 1,2
DB6: IC13.3(A2) ; also sheet 1,2
DB7: IC13.2(A1) ; also sheet 1,2
DB'0: IC13.11(B8) ; also sheet 3
DB'1: IC13.12(B7) ; also sheet 3
DB'2: IC13.13(B6) ; also sheet 3
DB'3: IC13.14(B5) ; also sheet 3
DB'4: IC13.15(B4) ; also sheet 3
DB'5: IC13.16(B3) ; also sheet 3
DB'6: IC13.17(B2) ; also sheet 3
DB'7: IC13.18(B1) ; also sheet 3
GND: C9.1.2 C10.1.2 C13.1.2 IC9.10(GND) IC9.19(G2) IC10.7(A6) IC10.8(A7) IC10.9(A8) IC10.10(GND) IC10.19(G2) IC13.10(GND) ; also sheet 1,2,3,4,5
R/!W!_09: IC13.1(DIR) ; also sheet 1,3
Unconnected: IC10.11(Y8) IC10.12(Y7) IC10.13(Y6)

### Buses
AB[0..18]
AB'[0..15]
DB[0..7]
DB'[0..7]

## Library data of the parts
3V3 GND TCK TDI TDO TMS = testpad:TP: Test pad
C1.2-C1.8 C1_1 C2.1 C3 C3.1 C4.1 C5.1 C6.1 C9 C9.1 C10.1 C13.1 C_O1.1 = rcl:C-US: CAPACITOR, American symbol
CART1 = commodore:CARTRIDGE_C64
GOLD_ORB_SM1 = oshw:OSHWLOGO: The OSHW logo for PCB layout
IC1 = xilinx_xc95XXXxl:XC95144XLTQG144
IC2 = memory-alliance:AS6C4008
IC3 = am29-memory:AM29F040J: 4-Megabit FLASH MEMORY (512 K x 8 bit) 5 V-only
IC4 = memory-jedec-jlb:JEDEC_32KB_SRAM: MEMORY
IC5 = micro-motorola:6809E: MICROCONTROLLER/MEMORY DEVICE
IC6 = pll-jlb:CLKPLL
IC9 IC10 = 74xx-us-jlb:74*541: Octal BUFFER and LINE DRIVER, 3-state
IC13 = 74xx-us-jlb:74*245: Octal BUS TRANSCEIVER, 3-state
LED1 = led:LED: LED OSRAM: - CHIPLED LG R971, LG N971, LY N971, LG Q971, LY Q971, LO R971, LY R971 LH N974, LH R974 LS Q976, LO Q976, LY Q976 LO Q996 - Hyper CHIPLED LW Q18S LB Q993, LB Q99A, LB R99A - SideLED LS A670, LO A670, LY A670, LG A670, LP A670 LB A673, LV A673, LT A673, LW A673 LH A674 LY A675 LS A676, LA A676, LO A676, LY A676, LW A676 LS A679, LY A679, LG A679 - Hyper Micro SIDELED® LS Y876, LA Y876, LO Y876, LY Y876 LT Y87S - SmartLED LW L88C, LW L88S LB L89C, LB L89S, LG L890 LS L89K, LO L89K, LY L89K LS L896, LA L896, LO L896, LY L896 - TOPLED LS T670, LO T670, LY T670, LG T670, LP T670 LSG T670, LSP T670, LSY T670, LOP T670, LYG T670 LG T671, LOG T671, LSG T671 LB T673, LV T673, LT T673, LW T673 LH T674 LS T676, LA T676, LO T676, LY T676, LB T676, LH T676, LSB T676, LW T676 LB T67C, LV T67C, LT T67C, LS T67K, LO T67K, LY T67K, LW E67C LS E67B, LA E67B, LO E67B, LY E67B, LB E67C, LV E67C, LT E67C LW T67C LS T679, LY T679, LG T679 LS T770, LO T770, LY T770, LG T770, LP T770 LB T773, LV T773, LT T773, LW T773 LH T774 LS E675, LA E675, LY E675, LS T675 LS T776, LA T776, LO T776, LY T776, LB T776 LHGB T686 LT T68C, LB T68C - Hyper Mini TOPLED® LB M676 - Mini TOPLED Santana® LG M470 LS M47K, LO M47K, LY M47K Source: http://www.osram.convergy.de LUXEON: - LUMILED® LXK2-PW12-R00, LXK2-PW12-S00, LXK2-PW14-U00, LXK2-PW14-V00 LXK2-PM12-R00, LXK2-PM12-S00, LXK2-PM14-U00 LXK2-PE12-Q00, LXK2-PE12-R00, LXK2-PE12-S00, LXK2-PE14-T00, LXK2-PE14-U00 LXK2-PB12-K00, LXK2-PB12-L00, LXK2-PB12-M00, LXK2-PB14-N00, LXK2-PB14-P00, LXK2-PB14-Q00 LXK2-PR12-L00, LXK2-PR12-M00, LXK2-PR14-Q00, LXK2-PR14-R00 LXK2-PD12-Q00, LXK2-PD12-R00, LXK2-PD12-S00 LXK2-PH12-R00, LXK2-PH12-S00 LXK2-PL12-P00, LXK2-PL12-Q00, LXK2-PL12-R00 Source: www.luxeon.com KINGBRIGHT: KA-3528ASYC Source: www.kingbright.com
OSC1 = crystal:ASE: 3.3Vdc CMOS SMD CRYSTAL CLOCK OSCILLATOR SOurce: www.abracon.com; OC_FARNELL: unknown; OC_NEWARK: unknown
R1 R3 = rcl:R-US_: RESISTOR, American symbol
S1 = switch-omron:31-XX: OMRON SWITCH; MPN: B3F-3100; OC_FARNELL: 959704; OC_NEWARK: 36M3582
SV1 = xilinx_xc95XXXxl:JTAG: PIN HEADER; OC_FARNELL: unknown; OC_NEWARK: unknown
SV2 SV3 = con-lstb-rp:MA07-2: PIN HEADER; OC_FARNELL: unknown; OC_NEWARK: unknown
VR1 = SparkFun:V_REG_LM1117: Voltage Regulator LM1117 Standard adjustable voltage regulator but in SMD form. Spark Fun Electronics SKU : COM-00595
X1 = commodore:EXPANSION_PORT_C64_EDGE

## Board
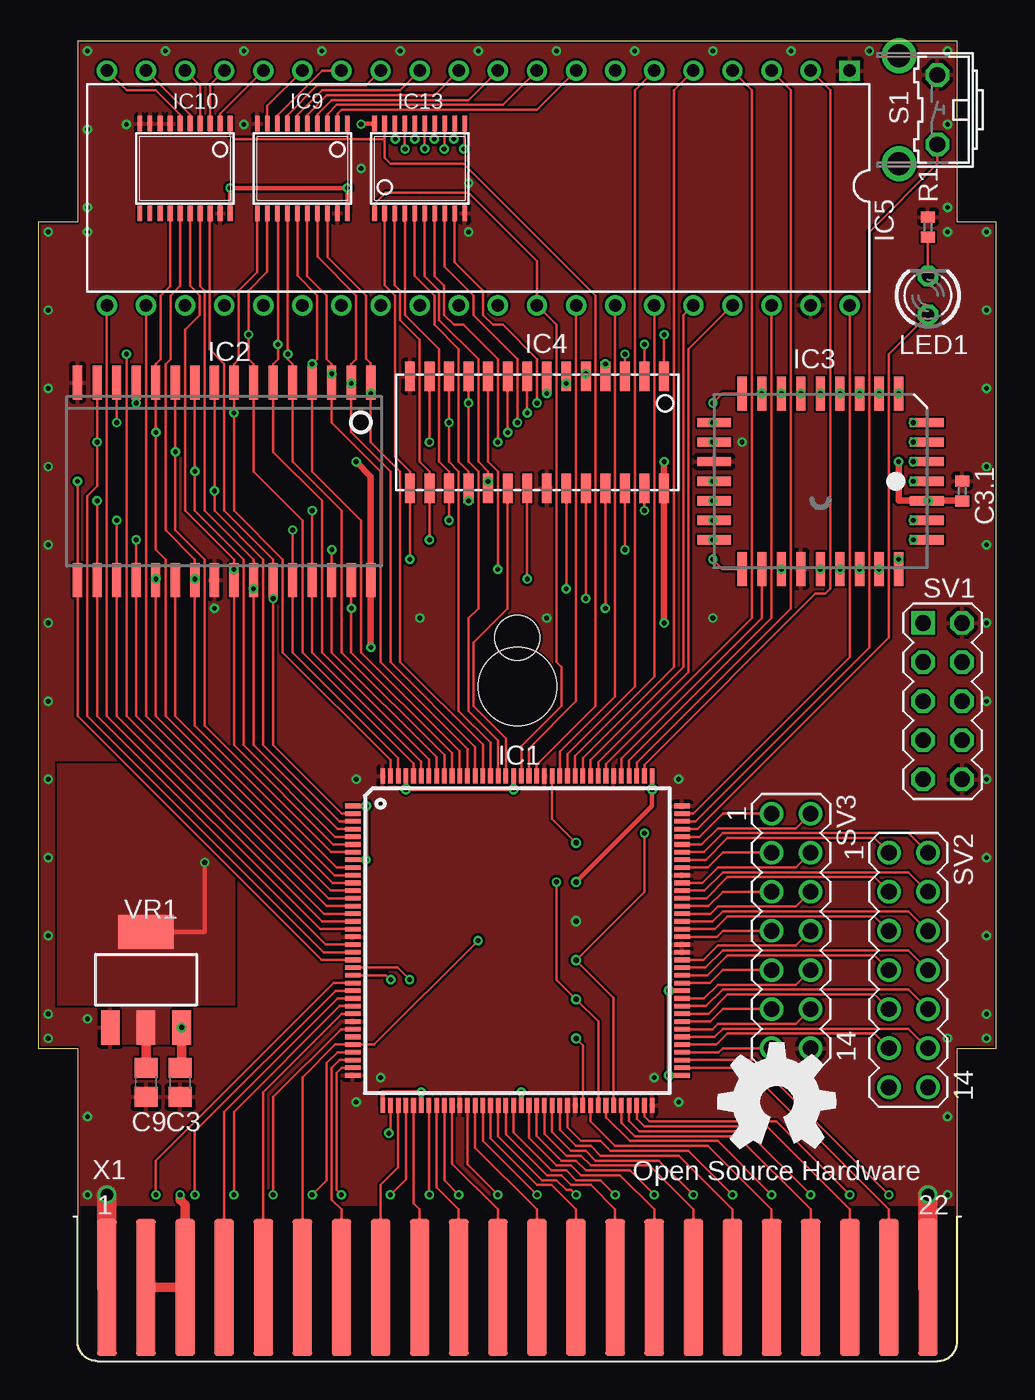
[diagram p6: board, top side]
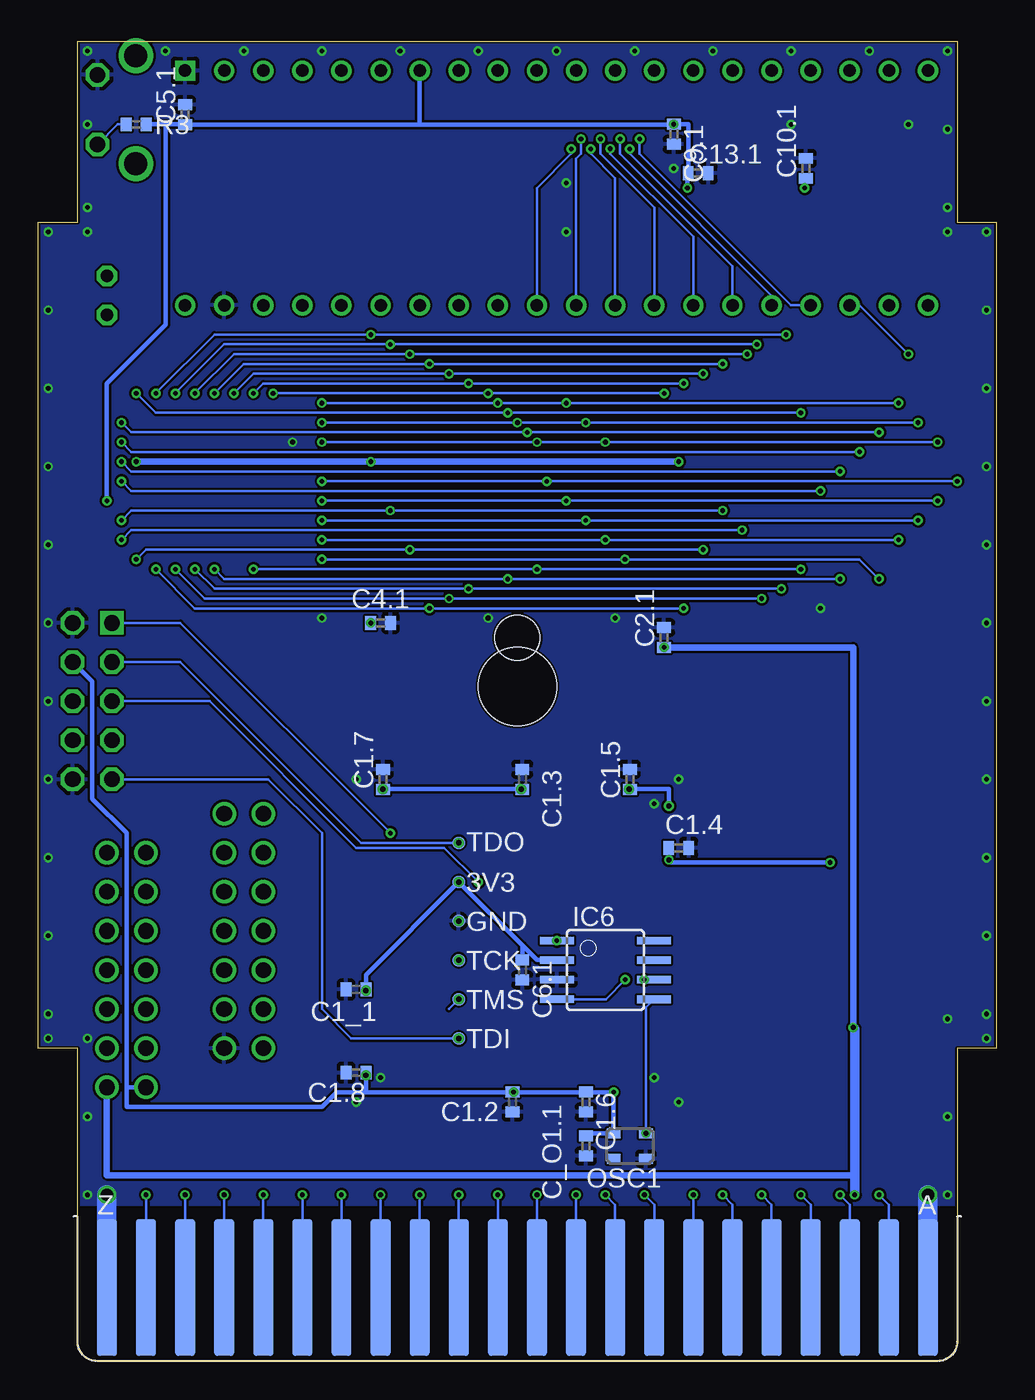
[diagram p7: board, bottom side, seen from below]

Size 62.23 x 85.72 mm. Coordinates in mm from the lower left corner, seen from the top.
Outline: 2.54,20.32 2.54,1.27 arc90 3.81,0 58.42,0 arc90 59.69,1.27 59.69,20.32 62.23,20.32 62.23,73.98 59.69,73.98 59.69,85.72 2.54,85.72 2.54,73.98 0,73.98 0,20.32 2.54,20.32
Copper layers (1*16): Top 0.035mm / dielectric 1.5mm / Bottom 0.035mm
Design rules "hackvana *": minimum track width 6mil, minimum drill 0.3mm, track to track 6mil, track to pad 6mil, pad to pad 6mil, via to via 6mil, smd to smd 0mil, copper to edge 6mil, drill to drill 6mil, minimum pad ring 10mil, minimum via ring 6mil, stop-mask expansion 2mil, vias tented up to drill 100mil, thermal gap 10mil

### Footprints (pad centres in the part's own frame; a part is rotated, then mirrored left to right if it is on the bottom)
TP08R = smd 0.8 x 0.8: TP 0,0
C0402 = smd 0.7 x 0.9: 1 -0.65,0; 2 0.65,0
C0805 = smd 1.3 x 1.5: 1 -0.95,0; 2 0.95,0
CARTRIDGE_C64 = hole 5.08: 0,43.815 | hole 2.921: 0,46.99
TQFP144 = smd 1 x 0.3: 1 -10.7,8.75; 2 -10.7,8.25; 3 -10.7,7.75; 4 -10.7,7.25; 5 -10.7,6.75; 6 -10.7,6.25; 7 -10.7,5.75; 8 -10.7,5.25; 9 -10.7,4.75; 10 -10.7,4.25; 11 -10.7,3.75; 12 -10.7,3.25; 13 -10.7,2.75; 14 -10.7,2.25; 15 -10.7,1.75; 16 -10.7,1.25; 17 -10.7,0.75; 18 -10.7,0.25; 19 -10.7,-0.25; 20 -10.7,-0.75; 21 -10.7,-1.25; 22 -10.7,-1.75; 23 -10.7,-2.25; 24 -10.7,-2.75; 25 -10.7,-3.25; 26 -10.7,-3.75; 27 -10.7,-4.25; 28 -10.7,-4.75; 29 -10.7,-5.25; 30 -10.7,-5.75; 31 -10.7,-6.25; 32 -10.7,-6.75; 33 -10.7,-7.25; 34 -10.7,-7.75; 35 -10.7,-8.25; 36 -10.7,-8.75; 73 10.7,-8.75; 74 10.7,-8.25; 75 10.7,-7.75; 76 10.7,-7.25; 77 10.7,-6.75; 78 10.7,-6.25; 79 10.7,-5.75; 80 10.7,-5.25; 81 10.7,-4.75; 82 10.7,-4.25; 83 10.7,-3.75; 84 10.7,-3.25; 85 10.7,-2.75; 86 10.7,-2.25; 87 10.7,-1.75; 88 10.7,-1.25; 89 10.7,-0.75; 90 10.7,-0.25; 91 10.7,0.25; 92 10.7,0.75; 93 10.7,1.25; 94 10.7,1.75; 95 10.7,2.25; 96 10.7,2.75; 97 10.7,3.25; 98 10.7,3.75; 99 10.7,4.25; 100 10.7,4.75; 101 10.7,5.25; 102 10.7,5.75; 103 10.7,6.25; 104 10.7,6.75; 105 10.7,7.25; 106 10.7,7.75; 107 10.7,8.25; 108 10.7,8.75 | smd 0.3 x 1: 37 -8.75,-10.7; 38 -8.25,-10.7; 39 -7.75,-10.7; 40 -7.25,-10.7; 41 -6.75,-10.7; 42 -6.25,-10.7; 43 -5.75,-10.7; 44 -5.25,-10.7; 45 -4.75,-10.7; 46 -4.25,-10.7; 47 -3.75,-10.7; 48 -3.25,-10.7; 49 -2.75,-10.7; 50 -2.25,-10.7; 51 -1.75,-10.7; 52 -1.25,-10.7; 53 -0.75,-10.7; 54 -0.25,-10.7; 55 0.25,-10.7; 56 0.75,-10.7; 57 1.25,-10.7; 58 1.75,-10.7; 59 2.25,-10.7; 60 2.75,-10.7; 61 3.25,-10.7; 62 3.75,-10.7; 63 4.25,-10.7; 64 4.75,-10.7; 65 5.25,-10.7; 66 5.75,-10.7; 67 6.25,-10.7; 68 6.75,-10.7; 69 7.25,-10.7; 70 7.75,-10.7; 71 8.25,-10.7; 72 8.75,-10.7; 109 8.75,10.7; 110 8.25,10.7; 111 7.75,10.7; 112 7.25,10.7; 113 6.75,10.7; 114 6.25,10.7; 115 5.75,10.7; 116 5.25,10.7; 117 4.75,10.7; 118 4.25,10.7; 119 3.75,10.7; 120 3.25,10.7; 121 2.75,10.7; 122 2.25,10.7; 123 1.75,10.7; 124 1.25,10.7; 125 0.75,10.7; 126 0.25,10.7; 127 -0.25,10.7; 128 -0.75,10.7; 129 -1.25,10.7; 130 -1.75,10.7; 131 -2.25,10.7; 132 -2.75,10.7; 133 -3.25,10.7; 134 -3.75,10.7; 135 -4.25,10.7; 136 -4.75,10.7; 137 -5.25,10.7; 138 -5.75,10.7; 139 -6.25,10.7; 140 -6.75,10.7; 141 -7.25,10.7; 142 -7.75,10.7; 143 -8.25,10.7; 144 -8.75,10.7
SOP32L = smd 0.6 x 2.2: 1 -9.525,-6.416; 2 -8.255,-6.416; 3 -6.985,-6.416; 4 -5.715,-6.416; 5 -4.445,-6.416; 6 -3.175,-6.416; 7 -1.905,-6.416; 8 -0.635,-6.416; 9 0.635,-6.416; 10 1.905,-6.416; 11 3.175,-6.416; 12 4.445,-6.416; 13 5.715,-6.416; 14 6.985,-6.416; 15 8.255,-6.416; 16 9.525,-6.416; 17 9.525,6.416; 18 8.255,6.416; 19 6.985,6.416; 20 5.715,6.416; 21 4.445,6.416; 22 3.175,6.416; 23 1.905,6.416; 24 0.635,6.416; 25 -0.635,6.416; 26 -1.905,6.416; 27 -3.175,6.416; 28 -4.445,6.416; 29 -5.715,6.416; 30 -6.985,6.416; 31 -8.255,6.416; 32 -9.525,6.416
PLCC32R = smd 0.6 x 2.2: 1 0,6.9; 2 -1.27,6.9; 3 -2.54,6.9; 4 -3.81,6.9; 14 -3.81,-6.9; 15 -2.54,-6.9; 16 -1.27,-6.9; 17 0,-6.9; 18 1.27,-6.9; 19 2.54,-6.9; 20 3.81,-6.9; 30 3.81,6.9; 31 2.54,6.9; 32 1.27,6.9 | smd 2.2 x 0.6: 5 -5.7,5.08; 6 -5.7,3.81; 7 -5.7,2.54; 8 -5.7,1.27; 9 -5.7,0; 10 -5.7,-1.27; 11 -5.7,-2.54; 12 -5.7,-3.81; 13 -5.7,-5.08; 21 5.7,-5.08; 22 5.7,-3.81; 23 5.7,-2.54; 24 5.7,-1.27; 25 5.7,0; 26 5.7,1.27; 27 5.7,2.54; 28 5.7,3.81; 29 5.7,5.08
SOJ32/3 = smd 0.635 x 1.905: 1 -8.255,-3.632; 2 -6.985,-3.632; 3 -5.715,-3.632; 4 -4.445,-3.632; 5 -3.175,-3.632; 6 -1.905,-3.632; 7 -0.635,-3.632; 8 0.635,-3.632; 9 1.905,-3.632; 10 3.175,-3.632; 11 4.445,-3.632; 12 5.715,-3.632; 13 6.985,-3.632; 14 8.255,-3.632; 15 8.255,3.632; 16 6.985,3.632; 17 5.715,3.632; 18 4.445,3.632; 19 3.175,3.632; 20 1.905,3.632; 21 0.635,3.632; 22 -0.635,3.632; 23 -1.905,3.632; 24 -3.175,3.632; 25 -4.445,3.632; 26 -5.715,3.632; 27 -6.985,3.632; 28 -8.255,3.632
DIL40-ROUNDPAD = drill 0.813 square: 1 -24.13,-7.62 | drill 0.813: 2 -21.59,-7.62; 3 -19.05,-7.62; 4 -16.51,-7.62; 5 -13.97,-7.62; 6 -11.43,-7.62; 7 -8.89,-7.62; 8 -6.35,-7.62; 9 -3.81,-7.62; 10 -1.27,-7.62; 11 1.27,-7.62; 12 3.81,-7.62; 13 6.35,-7.62; 14 8.89,-7.62; 15 11.43,-7.62; 16 13.97,-7.62; 17 16.51,-7.62; 18 19.05,-7.62; 19 21.59,-7.62; 20 24.13,-7.62; 21 24.13,7.62; 22 21.59,7.62; 23 19.05,7.62; 24 16.51,7.62; 25 13.97,7.62; 26 11.43,7.62; 27 8.89,7.62; 28 6.35,7.62; 29 3.81,7.62; 30 1.27,7.62; 31 -1.27,7.62; 32 -3.81,7.62; 33 -6.35,7.62; 34 -8.89,7.62; 35 -11.43,7.62; 36 -13.97,7.62; 37 -16.51,7.62; 38 -19.05,7.62; 39 -21.59,7.62; 40 -24.13,7.62
SOIC8 = smd 0.5 x 2.2: 1 -1.905,-3.154; 2 -0.645,-3.154; 3 0.625,-3.154; 4 1.895,-3.154; 5 1.905,3.154; 6 0.635,3.154; 7 -0.635,3.154; 8 -1.905,3.154
TSSOP20 = smd 0.305 x 0.991: 1 -2.925,-2.918; 2 -2.275,-2.918; 3 -1.625,-2.918; 4 -0.975,-2.918; 5 -0.325,-2.918; 6 0.325,-2.918; 7 0.975,-2.918; 8 1.625,-2.918; 9 2.275,-2.918; 10 2.925,-2.918; 11 2.925,2.918; 12 2.275,2.918; 13 1.625,2.918; 14 0.975,2.918; 15 0.325,2.918; 16 -0.325,2.918; 17 -0.975,2.918; 18 -1.625,2.918; 19 -2.275,2.918; 20 -2.925,2.918
LED3MM = drill 0.813 octagon: A -1.27,0; K 1.27,0
ASE = smd 0.9 x 0.65: 1 -1.05,-0.825; 2 1.05,-0.825; 3 1.05,0.825; 4 -1.05,0.825
R0402 = smd 0.7 x 0.9: 1 -0.65,0; 2 0.65,0
B3F-31XX = drill 1.016 octagon: 1 -2.261,-1.245; 2 2.261,-1.245 | drill 1.499 pad 2.159: 3 -3.505,1.245; 4 3.505,1.245
JTAG = drill 1.016 square: 1 -5.08,-1.27 | drill 1.016 octagon: 2 -5.08,1.27; 3 -2.54,-1.27; 4 -2.54,1.27; 5 0,-1.27; 6 0,1.27; 7 2.54,-1.27; 8 2.54,1.27; 9 5.08,-1.27; 10 5.08,1.27
MA07-2 = drill 1.016: 1 -7.62,-1.27; 2 -7.62,1.27; 3 -5.08,-1.27; 4 -5.08,1.27; 5 -2.54,-1.27; 6 -2.54,1.27; 7 0,-1.27; 8 0,1.27; 9 2.54,-1.27; 10 2.54,1.27; 11 5.08,-1.27; 12 5.08,1.27; 13 7.62,-1.27; 14 7.62,1.27
SOT223 = smd 1.219 x 2.235: 1 -2.311,-3.099; 2 0,-3.099; 3 2.311,-3.099 | smd 3.6 x 2.2: 4 0,3.099
MA100-22-2 = smd 1.27 x 8.89: 1 -26.67,-0.305; 2 -24.13,-0.305; 3 -21.59,-0.305; 4 -19.05,-0.305; 5 -16.51,-0.305; 6 -13.97,-0.305; 7 -11.43,-0.305; 8 -8.89,-0.305; 9 -6.35,-0.305; 10 -3.81,-0.305; 11 -1.27,-0.305; 12 1.27,-0.305; 13 3.81,-0.305; 14 6.35,-0.305; 15 8.89,-0.305; 16 11.43,-0.305; 17 13.97,-0.305; 18 16.51,-0.305; 19 19.05,-0.305; 20 21.59,-0.305; 21 24.13,-0.305; 22 26.67,-0.305 | smd 1.27 x 8.89 bottom: A -26.67,-0.305; B -24.13,-0.305; C -21.59,-0.305; D -19.05,-0.305; E -16.51,-0.305; F -13.97,-0.305; H -11.43,-0.305; J -8.89,-0.305; K -6.35,-0.305; L -3.81,-0.305; M -1.27,-0.305; N 1.27,-0.305; P 3.81,-0.305; R 6.35,-0.305; S 8.89,-0.305; T 11.43,-0.305; U 13.97,-0.305; V 16.51,-0.305; W 19.05,-0.305; X 21.59,-0.305; Y 24.13,-0.305; Z 26.67,-0.305

### Placement (x,y rotation side)
3V3  34.92,31.11 90 bottom
C1.2  31.43,16.83 270 bottom
C1.3  30.8,37.78 90 bottom
C1.4  20.64,33.34 0 bottom
C1.5  23.81,37.78 90 bottom
C1.6  26.67,16.83 270 bottom
C1.7  39.85,37.78 90 bottom
C1.8  41.59,18.73 180 bottom
C1_1  41.59,24.13 180 bottom
C2.1  21.59,46.99 90 bottom
C3  9.21,18.1 270 top
C3.1  60.01,56.52 90 top
C4.1  40,47.94 0 bottom
C5.1  52.7,80.96 90 bottom
C6.1  30.8,25.4 270 bottom
C9  6.98,18.1 270 top
C9.1  20.95,79.69 270 bottom
C10.1  12.38,77.47 90 bottom
C13.1  19.37,77.15 0 bottom
C_O1.1  26.67,13.97 270 bottom
CART1  31.11,0 0 top
GND  34.92,28.57 0 bottom
GOLD_ORB_SM1  47.94,16.83 0 top
IC1  31.11,27.3 0 top
IC2  12.06,57.15 180 top
IC3  50.8,57.15 270 top
IC4  32.38,60.33 180 top
IC5  28.57,76.2 180 top
IC6  25.4,25.4 270 bottom
IC9  17.14,77.47 180 top
IC10  9.52,77.47 180 top
IC13  24.77,77.47 0 top
LED1  57.78,69.22 90 top
OSC1  23.81,13.97 0 bottom
R1  57.78,73.66 90 top
R3  55.88,80.33 0 bottom
S1  57.15,81.28 90 top
SV1  58.74,42.86 270 top
SV2  56.52,25.4 270 top
SV3  48.89,27.94 270 top
TCK  34.92,26.04 0 bottom
TDI  34.92,20.95 90 bottom
TDO  34.92,33.66 0 bottom
TMS  34.92,23.5 90 bottom
VR1  6.98,24.77 0 top
X1  31.11,5.08 0 top

### Tracks (layer width: path | path; a pad name or v marks a point on that pad's centre or on a via)
!CE_DAT
  Top 0.152: IC4.20 30.48,48.9 28.26,46.67 28.26,42.55 30.36,40.44 IC1.128
!CE_FLASH
  Top 0.152: IC3.22 46.99,48.26 37.86,39.13 IC1.113
!CE_RAM
  Top 0.152: IC1.10 19.24,31.55 8.89,41.91 IC2.22
!DMA
  Top 0.152: X1.13 34.92,9.84 33.34,11.43 32.38,11.43 29.36,14.45 IC1.51
!EN_BUS
  Top 0.152: IC10.1 12.45,79.62 12.7,79.38 20.07,79.38 | 22.49,79.38 20.07,79.38 | IC9.1 20.07,79.38 | IC13.19 22.49,79.38 | 22.49,79.38 22.49,78.16 22.86,77.79 27.62,77.79 36.2,69.22 36.2,42.55 32.36,38.72 IC1.124
!EXROM
  Top 0.152: IC1.41 24.36,10.24 24.77,9.84 X1.9
!FIRQ_09
  Top 0.152: IC5.4 46.35,82.55 46.35,48.26 36.86,38.77 IC1.115
!GAME
  Top 0.152: IC1.39 23.36,12.57 22.22,11.43 X1.8
!HALT_09
  Top 0.152: IC5.40 52.7,45.72 42.54,35.55 IC1.107
!IO1
  Top 0.152: IC1.34 19.55,19.55 19.05,19.05 19.05,10.48 19.68,9.84 X1.7
!IO2
  Top 0.152: IC1.44 25.86,11.28 27.3,9.84 X1.10
!IRQ
  Top 0.152: IC1.26 19.43,23.55 12.06,16.19 X1.4
!IRQ_09
  Top 0.152: IC5.3 48.89,82.55 48.89,48.9 38.86,38.87 IC1.111
!NMI  (via drill 0.3)
  Top 0.152: IC1.27 19.56,23.05 12.7,16.19 v12.7,10.79
  Bottom 0.152: X1.D 12.06,10.16 v12.7,10.79
!NMI_09
  Top 0.152: IC5.2 51.44,82.55 51.44,50.16 51.12,49.85 50.48,49.85 39.36,38.73 IC1.110
!RESET  (via drill 0.3)
  Top 0.152: IC1.25 19.29,24.05 10.16,14.92 v10.16,10.79
  Bottom 0.152: X1.C 9.52,10.16 v10.16,10.79
!RESET_09
  Top 0.152: IC5.37 42.23,65.72 42.23,44.77 36.36,38.91 IC1.116
!ROMH  (via drill 0.3)
  Top 0.152: IC1.24 19.16,24.55 7.62,13.02 v7.62,10.79
  Bottom 0.152: v7.62,10.79 6.98,10.16 X1.B
!ROML
  Top 0.152: IC1.46 26.86,12.82 29.84,9.84 X1.11
!WE  (via drill 0.3)
  Top 0.152: IC3.31 v56.83,54.61 | v17.78,55.24 IC2.29 17.78,46.04 24.86,38.95 IC1.139 | IC4.27 v39.37,55.24
  Bottom 0.152: v56.83,54.61 56.2,55.24 v39.37,55.24 v17.78,55.24
+3V3  (via drill 0.3, 0.36)
  Top 0.305: IC1.1 v21.27,36.05 v21.27,32.55 IC1.8 | IC1.37 22.36,17.46 v24.86,17.46 IC1.42 | v10.79,32.38 10.79,27.86 VR1.4 | IC1.141 v23.86,37.15 v30.86,37.15 IC1.127 | IC1.55 v31.36,17.46 | IC1.73 v40.96,18.55 v40.96,24.05 IC1.84 | IC1.109 v39.86,37.15 39.86,36.05 3V3.TP
  Top 0.61: C9.1 VR1.2
  Bottom 0.305: C_O1.1.1 26.67,14.79 OSC1.4 | v10.79,32.38 21.27,32.38 v21.27,32.55 21.29,32.55 C1.4.1 | OSC1.4 v24.86,17.46 26.67,17.46 | 30.8,17.46 v31.36,17.46 31.42,17.46 C1.2.1 | 30.8,17.46 26.67,17.46 | C1_1.1 40.94,24.07 v40.96,24.05 40.96,25.08 3V3.TP 30.8,26.99 | 40.96,17.45 v40.96,18.55 40.94,18.55 C1.8.1 | v21.27,36.05 21.27,37.15 v23.86,37.15 23.86,37.13 C1.5.1 | IC6.2 29.85,26.05 30.8,26.99 | C6.1.1 30.8,26.99 | 40.96,17.45 30.81,17.45 30.8,17.46 | C1.6.1 26.67,17.46 | C1.3.1 30.8,37.15 v30.86,37.15 v39.86,37.15 39.86,37.13 C1.7.1 | SV1.4 58.74,44.13 58.74,36.51 56.52,34.29 56.52,17.78 | OSC1.4 | 56.52,17.78 56.52,16.51 43.81,16.51 42.86,17.46 40.97,17.46 40.96,17.45 | SV2.13 56.52,17.78
  other vias: 34.92,31.11
  pour Top (no thermals): 5.4,20.64 5.4,23.18 1.27,23.18 1.27,38.73 12.7,38.73 12.7,23.18 8.57,23.18 8.57,20.64
+5V  (via drill 0.3)
  Top 0.305: IC10.20 v12.45,76.2 v20.07,76.2 IC9.20 | 21.84,80.31 IC13.20 20.95,80.39 C9.1.1
  Top 0.406: v20.64,58.42 21.59,57.47 IC2.32 v21.59,46.35 | v40.64,58.42 IC4.28 v40.64,47.94 | v55.88,58.42 55.88,55.88 IC3.32 v57.78,55.88 C3.1.1
  Top 0.61: C3.1 arc45 9.3,19.26 VR1.3 | X1.2 X1.3 9.52,10.16 9.21,10.48 v9.21,10.79
  Bottom 0.305: C10.1.1 12.38,76.2 v12.45,76.2 | 20,76.2 v20.07,76.2 20.07,77.1 C13.1.1 20.02,80.34 C9.1.1 20.98,80.31 37.46,80.31 | IC5.7 37.46,80.31 | 37.46,80.31 C5.1.1 52.7,80.33 53.97,80.33 | R3.2 53.97,80.33 | 53.97,80.33 53.97,67.31 57.78,63.5 v57.78,55.88
  Bottom 0.406: v20.64,58.42 v40.64,58.42 v55.88,58.42 | C2.1.1 v21.59,46.35 9.3,46.35 VR1.3 | C4.1.1 40.66,47.93 v40.64,47.94 | SV2.14 57.78,12.06 9.21,12.06
  Bottom 0.61: v9.21,10.79 9.21,12.06 9.21,21.58 VR1.3
  other vias: 9.3,21.67 20.95,80.34
A0  (via drill 0.3)
  Top 0.152: IC1.75 46.48,19.55 v55.24,10.79
  Bottom 0.152: v55.24,10.79 X1.Y
A1  (via drill 0.3)
  Top 0.152: v52.7,10.79 47.94,15.56 39.69,15.56 39.36,15.88 IC1.71
  Bottom 0.152: v52.7,10.79 X1.X
A2  (via drill 0.3)
  Top 0.152: v50.16,10.79 46.04,14.92 39.05,14.92 38.36,15.61 IC1.69
  Bottom 0.152: v50.16,10.79 X1.W
A3  (via drill 0.3)
  Top 0.152: v47.62,10.79 44.13,14.29 38.42,14.29 36.86,15.84 IC1.66
  Bottom 0.152: v47.62,10.79 X1.V
A4  (via drill 0.3)
  Top 0.152: v45.09,10.79 42.23,13.65 37.15,13.65 36.51,14.29 35.24,14.29 34.36,15.16 IC1.61
  Bottom 0.152: v45.09,10.79 X1.U
A5  (via drill 0.3)
  Top 0.152: v42.55,10.79 40.32,13.02 36.2,13.02 35.56,13.65 34.61,13.65 33.36,14.89 IC1.59
  Bottom 0.152: v42.55,10.79 X1.T
A6  (via drill 0.3)
  Top 0.152: v40,10.79 38.42,12.38 35.56,12.38 34.92,13.02 33.97,13.02 32.36,14.62 IC1.57
  Bottom 0.152: v40,10.79 X1.S
A7  (via drill 0.3)
  Top 0.152: v37.46,10.79 36.51,11.75 34.92,11.75 34.29,12.38 33.34,12.38 30.86,14.86 IC1.54
  Bottom 0.152: v37.46,10.79 X1.R
A8  (via drill 0.3)
  Top 0.152: v34.92,10.79 34.61,11.11 34.29,11.11 33.66,11.75 32.7,11.75 29.86,14.59 IC1.52
  Bottom 0.152: X1.P v34.92,10.79
A9  (via drill 0.3)
  Top 0.152: v32.38,10.79 28.86,14.31 IC1.50
  Bottom 0.152: v32.38,10.79 X1.N
A10  (via drill 0.3)
  Top 0.152: v29.84,10.79 27.86,12.78 IC1.48
  Bottom 0.152: X1.M v29.84,10.79
A11  (via drill 0.3)
  Top 0.152: IC1.45 26.36,11.73 v27.3,10.79
  Bottom 0.152: v27.3,10.79 X1.L
A12  (via drill 0.3)
  Top 0.152: IC1.43 25.36,10.83 v25.4,10.79
  Bottom 0.152: v25.4,10.79 24.77,10.16 X1.K
A13  (via drill 0.3)
  Top 0.152: v22.86,10.79 23.86,11.8 IC1.40
  Bottom 0.152: X1.J 22.22,10.16 v22.86,10.79
A14  (via drill 0.3)
  Top 0.152: IC1.35 19.69,19.05 19.37,18.73 19.37,11.11 v19.68,10.79
  Bottom 0.152: v19.68,10.79 X1.H
A15  (via drill 0.3)
  Top 0.152: IC1.33 19.42,20.05 18.73,19.37 18.73,11.75 v17.78,10.79
  Bottom 0.152: v17.78,10.79 17.14,10.16 X1.F
AB0  (via drill 0.3)
  Top 0.152: IC3.12 v46.99,62.87 | IC9.18 18.77,71.72 21.27,69.22 21.27,65.12 21.59,64.81 IC2.1 v21.59,62.87 21.59,59.69 23.49,57.78 23.49,45.4 28.86,40.03 IC1.131 | IC4.7 v33.02,62.87
  Bottom 0.152: v46.99,62.87 v33.02,62.87 v21.59,62.87
AB1  (via drill 0.3)
  Top 0.152: IC3.11 v48.26,62.87 | IC9.17 18.12,71.73 20.64,69.22 20.64,65.09 20.32,64.77 IC2.2 v20.32,63.5 20.32,60.33 22.86,57.78 22.86,45.4 28.36,39.9 IC1.132 | IC4.6 v34.29,63.5
  Bottom 0.152: v48.26,62.87 47.62,63.5 v34.29,63.5 v20.32,63.5
AB2  (via drill 0.3)
  Top 0.152: IC3.10 v49.53,62.87 | IC9.16 17.46,70.48 18.73,69.22 18.73,65.09 19.05,64.77 v19.05,64.14 IC2.3 19.05,60.96 22.22,57.78 22.22,45.4 27.86,39.76 IC1.133 | IC4.5 v35.56,64.14
  Bottom 0.152: v49.53,62.87 48.26,64.14 v35.56,64.14 v19.05,64.14
AB3  (via drill 0.3)
  Top 0.152: IC3.9 v50.8,62.87 | IC9.15 16.82,70.49 18.1,69.22 18.1,65.09 v17.78,64.77 IC2.4 17.78,57.78 20.95,54.61 20.95,46.04 27.36,39.63 IC1.134 | IC4.4 v36.83,64.77
  Bottom 0.152: v50.8,62.87 48.89,64.77 v36.83,64.77 v17.78,64.77
AB4  (via drill 0.3)
  Top 0.152: v52.07,62.87 IC3.8 | IC9.14 16.17,74 16.19,73.98 v16.19,65.41 16.19,65.09 16.51,64.77 IC2.5 16.51,58.42 19.68,55.24 19.68,46.04 26.36,39.36 IC1.136 | IC4.3 v38.1,65.41
  Bottom 0.152: v52.07,62.87 49.53,65.41 v38.1,65.41 v16.19,65.41
AB5  (via drill 0.3)
  Top 0.152: IC3.7 v53.34,62.87 | IC9.13 15.52,74.02 15.56,73.98 v15.56,66.04 15.56,65.09 15.24,64.77 IC2.6 15.24,59.05 18.41,55.88 18.41,46.04 25.36,39.09 IC1.138 | IC4.2 v39.37,66.04
  Bottom 0.152: v53.34,62.87 50.16,66.04 v39.37,66.04 v15.56,66.04
AB6  (via drill 0.3)
  Top 0.152: IC3.6 v54.61,62.87 | IC9.12 14.87,70.75 13.65,69.53 v13.65,66.67 13.65,65.09 13.97,64.77 IC2.7 13.97,57.78 17.14,54.61 17.14,46.04 24.36,38.82 IC1.140 | IC4.1 v40.64,66.67
  Bottom 0.152: v54.61,62.87 50.8,66.67 v40.64,66.67 v13.65,66.67
AB7  (via drill 0.3)
  Top 0.152: IC3.5 v55.88,62.87 | IC9.11 14.22,70.73 13.02,69.53 13.02,65.09 12.7,64.77 IC2.8 v12.7,61.59 12.7,55.24 15.87,52.07 15.87,46.04 22.86,39.05 IC1.143 | IC4.8 v31.75,61.59
  Bottom 0.152: v55.88,62.87 54.61,61.59 v31.75,61.59 v12.7,61.59
AB8  (via drill 0.3)
  Top 0.152: v53.34,51.45 v53.34,51.44 | IC10.18 11.15,74.02 11.11,73.98 11.11,65.72 12.06,64.77 12.06,55.24 15.24,52.07 IC2.27 v15.24,49.53 15.24,40.01 19.69,35.55 IC1.2 | IC4.24 v35.56,49.53
  Bottom 0.152: v53.34,51.44 51.44,49.53 v35.56,49.53 v15.24,49.53
AB9  (via drill 0.3)
  Top 0.152: IC3.26 v52.07,51.44 | IC10.17 10.5,69.83 10.79,69.53 10.79,55.24 13.97,52.07 IC2.26 v13.97,50.16 13.97,40.01 19.42,34.55 IC1.4 | IC4.23 v34.29,50.16
  Bottom 0.152: v52.07,51.44 50.8,50.16 v34.29,50.16 v13.97,50.16
AB10  (via drill 0.3)
  Top 0.152: IC3.23 v48.26,51.44 | IC10.16 9.85,69.84 10.48,69.22 10.48,67.94 9.52,66.99 9.52,55.24 12.7,52.07 v12.7,51.44 IC2.25 12.7,40.01 19.15,33.55 IC1.6 | IC4.10 29.21,58.42 29.84,57.78 v29.84,51.44
  Bottom 0.152: v48.26,51.44 v29.84,51.44 v12.7,51.44
AB11  (via drill 0.3)
  Top 0.152: IC3.25 v50.8,51.44 | IC10.15 9.2,69.84 8.57,69.22 8.57,65.09 8.25,64.77 8.25,53.98 10.16,52.07 v10.16,50.8 IC2.23 10.16,41.27 19.38,32.05 IC1.9 | IC4.21 v31.75,50.8
  Bottom 0.152: v50.8,51.44 50.16,50.8 v31.75,50.8 v10.16,50.8
AB12  (via drill 0.3)
  Top 0.152: IC3.4 v56.83,60.96 | IC10.14 8.55,69.83 7.94,69.22 7.94,65.09 7.62,64.77 IC2.12 v7.62,60.33 7.62,52.7 8.25,52.07 8.25,41.91 19.11,31.05 IC1.11 | IC4.9 v30.48,60.33
  Bottom 0.152: v56.83,60.96 56.2,60.33 v30.48,60.33 v7.62,60.33
AB13  (via drill 0.3)
  Top 0.152: v54.61,51.45 v54.61,51.44 | IC2.31 v20.32,48.9 20.32,46.04 26.86,39.49 IC1.135 | IC4.25 v36.83,48.9
  Bottom 0.152: v54.61,51.44 52.07,48.9 v36.83,48.9 v20.32,48.9
AB14  (via drill 0.3)
  Top 0.152: IC3.29 v55.88,52.07 | v19.05,52.7 IC2.30 19.05,46.04 25.86,39.22 IC1.137 | IC4.26 v38.1,52.7
  Bottom 0.152: v55.88,52.07 55.24,52.7 v38.1,52.7 v19.05,52.7
AB15  (via drill 0.3)
  Top 0.152: IC3.3 v56.83,59.69 | IC2.11 v8.89,59.05 8.89,53.98 10.79,52.07 10.79,41.27 19.02,33.05 IC1.7
  Bottom 0.152: v56.83,59.69 56.2,59.05 v8.89,59.05
AB16  (via drill 0.3)
  Top 0.152: IC3.2 v56.83,58.42 | IC2.10 v10.16,57.78 10.16,55.24 13.33,52.07 13.33,40.01 19.28,34.05 IC1.5
  Bottom 0.152: v56.83,58.42 56.2,57.78 v10.16,57.78
AB17  (via drill 0.3)
  Top 0.152: IC3.30 v56.83,53.34 | v16.51,53.98 IC2.28 16.51,46.04 23.36,39.18 IC1.142
  Bottom 0.152: v56.83,53.34 56.2,53.98 v16.51,53.98
AB18  (via drill 0.3)
  Top 0.152: IC3.1 v56.83,57.15 | IC2.9 v11.43,56.52 11.43,55.24 14.6,52.07 14.6,40.01 19.55,35.05 IC1.3
  Bottom 0.152: v56.83,57.15 56.2,56.52 v11.43,56.52
AB'0
  Top 0.152: IC5.8 32.38,81.28 19.68,81.28 19.42,81.02 IC9.2
AB'1
  Top 0.152: IC5.9 30.16,81.6 19.37,81.6 18.77,81 IC9.3
AB'2
  Top 0.152: IC5.10 27.94,81.92 19.05,81.92 18.12,80.98 IC9.4
AB'3
  Top 0.152: IC5.11 25.72,82.23 18.73,82.23 17.47,80.97 IC9.5
AB'4
  Top 0.152: IC5.12 23.49,82.55 18.41,82.55 16.82,80.95 IC9.6
AB'5
  Top 0.152: IC5.13 21.27,82.87 18.1,82.87 16.17,80.94 IC9.7
AB'6
  Top 0.152: IC5.14 18.41,83.82 15.52,80.92 IC9.8
AB'7
  Top 0.152: IC5.15 14.87,81.55 IC9.9
AB'8
  Top 0.152: IC10.2 11.8,81.02 IC5.16
AB'9
  Top 0.152: IC5.17 11.15,82.91 IC10.3
AB'10
  Top 0.152: IC5.18 10.5,82.84 IC10.4
AB'11
  Top 0.152: IC5.19 9.85,80.95 IC10.5
AB'12
  Top 0.152: IC5.20 5.71,82.55 7.62,82.55 9.2,80.97 IC10.6
AB'13
  Top 0.152: IC5.21 4.44,41.91 18.3,28.05 IC1.17
AB'14
  Top 0.152: IC5.22 6.98,41.91 18.84,30.05 IC1.13
AB'15  (via drill 0.3)
  Top 0.152: v5.71,65.41 5.71,41.91 18.57,29.05 IC1.15
  Bottom 0.152: IC5.23 8.89,68.58 v5.71,65.41
AVMA_09
  Top 0.152: IC5.36 41.91,67.94 41.91,45.09 35.86,39.04 IC1.117
BA
  Top 0.152: X1.12 32.38,9.84 28.36,13.86 IC1.49
BA_09
  Top 0.152: IC5.6 38.73,82.55 38.73,43.81 34.36,39.45 IC1.120
BS_09
  Top 0.152: IC5.5 41.27,82.55 41.27,45.09 35.36,39.17 IC1.118
BUSY_09
  Top 0.152: IC5.33 34.92,42.86 31.86,39.8 IC1.125
D0
  Top 0.152: X1.21 55.24,9.84 46.03,19.05 IC1.74
D1
  Top 0.152: X1.20 52.7,9.84 47.31,15.24 39.37,15.24 38.86,15.74 IC1.70
D2
  Top 0.152: X1.19 50.16,9.84 45.4,14.61 38.73,14.61 37.86,15.47 IC1.68
D3
  Top 0.152: X1.18 47.62,9.84 43.5,13.97 37.46,13.97 35.86,15.57 IC1.64
D4
  Top 0.152: X1.17 45.09,9.84 41.59,13.34 36.51,13.34 35.88,13.97 34.92,13.97 33.86,15.03 IC1.60
D5
  Top 0.152: X1.16 42.55,9.84 39.69,12.7 35.88,12.7 35.24,13.34 34.29,13.34 32.86,14.76 IC1.58
D6
  Top 0.152: X1.15 40,9.84 37.78,12.06 35.24,12.06 34.61,12.7 33.66,12.7 31.86,14.49 IC1.56
D7
  Top 0.152: X1.14 37.46,9.84 35.88,11.43 34.61,11.43 33.97,12.06 33.02,12.06 30.36,14.72 IC1.53
DB0  (via drill 0.3)
  Top 0.152: IC3.13 44.44,62.85 v43.81,62.23 | IC2.13 v6.35,62.23 | IC13.9 27.04,71.39 28.89,69.53 28.89,67.94 29.53,67.31 30.16,67.31 32.38,65.09 v32.38,62.23 | IC4.11 v27.94,62.23 27.94,58.42 28.57,57.78 28.57,48.9 27.94,48.26 27.94,42.23 29.86,40.3 IC1.129
  Bottom 0.152: v43.81,62.23 v32.38,62.23 v27.94,62.23 v6.35,62.23
DB1  (via drill 0.3)
  Top 0.152: IC3.14 v43.81,60.96 | IC2.14 v5.08,60.96 | IC13.8 26.39,71.08 28.26,69.22 28.26,67.94 31.11,65.09 v31.11,60.96 | IC4.12 v26.67,60.96 26.67,58.42 27.3,57.78 27.3,42.23 29.36,40.17 IC1.130
  Bottom 0.152: v43.81,60.96 v31.11,60.96 v26.67,60.96 v5.08,60.96
DB2  (via drill 0.3)
  Top 0.152: IC3.15 v43.81,59.69 | IC2.15 v3.81,59.69 3.81,56.83 3.17,56.2 3.17,41.91 18.53,26.55 IC1.20 | IC13.7 25.74,70.46 26.35,69.85 26.35,67.94 26.99,67.31 27.62,67.31 29.84,65.09 v29.84,59.69 | IC4.13 v25.4,59.69
  Bottom 0.152: v43.81,59.69 v29.84,59.69 v25.4,59.69 v3.81,59.69
DB3  (via drill 0.3)
  Top 0.152: IC3.17 v43.81,57.15 | v2.54,57.15 IC2.17 2.54,41.91 18.39,26.05 IC1.21 | IC13.6 25.09,70.48 26.03,69.53 26.03,67.63 28.57,65.09 28.57,58.42 29.21,57.78 v29.21,57.15 IC4.19
  Bottom 0.152: v43.81,57.15 v29.21,57.15 v2.54,57.15
DB4  (via drill 0.3)
  Top 0.152: IC3.18 v43.81,55.88 | v3.81,55.88 IC2.18 3.81,41.91 18.66,27.05 IC1.19 | IC13.5 24.44,70.49 25.72,69.22 25.72,67.31 27.3,65.72 27.3,58.42 27.94,57.78 IC4.18 v27.94,55.88
  Bottom 0.152: v43.81,55.88 v27.94,55.88 v3.81,55.88
DB5  (via drill 0.3)
  Top 0.152: IC3.19 v43.81,54.61 | v5.08,54.61 IC2.19 5.08,41.91 18.43,28.55 IC1.16 | IC13.4 23.79,74 23.81,73.98 23.81,67.94 26.03,65.72 26.03,58.42 26.67,57.78 IC4.17 v26.67,54.61
  Bottom 0.152: v43.81,54.61 v26.67,54.61 v5.08,54.61
DB6  (via drill 0.3)
  Top 0.152: IC3.20 v43.81,53.34 | v6.35,53.34 IC2.20 6.35,41.91 18.7,29.55 IC1.14 | IC13.3 23.14,69.89 23.49,69.53 23.49,67.63 24.77,66.36 24.77,58.42 25.4,57.78 IC4.16 v25.4,53.34
  Bottom 0.152: v43.81,53.34 v25.4,53.34 v6.35,53.34
DB7  (via drill 0.3)
  Top 0.152: v7.62,50.8 IC2.21 7.62,41.91 18.97,30.55 IC1.12 | v43.81,52.07 44.44,51.45 IC3.21 | IC13.2 22.49,69.9 23.18,69.22 23.18,58.74 24.13,57.78 IC4.15 v24.13,52.07
  Bottom 0.152: v7.62,50.8 8.89,52.07 v24.13,52.07 v43.81,52.07
DB'0  (via drill 0.3)
  Top 0.152: IC13.11 27.69,78.81 v27.62,78.74
  Bottom 0.152: v27.62,78.74 27.62,78.42 29.84,76.2 IC5.31
DB'1  (via drill 0.3)
  Top 0.152: IC13.12 27.04,79.43 v26.99,79.38
  Bottom 0.152: v26.99,79.38 26.99,78.42 27.3,78.11 IC5.30
DB'2  (via drill 0.3)
  Top 0.152: IC13.13 26.39,78.78 v26.35,78.74
  Bottom 0.152: v26.35,78.74 26.35,78.42 24.77,76.83 IC5.29
DB'3  (via drill 0.3)
  Top 0.152: IC13.14 25.74,79.4 v25.72,79.38
  Bottom 0.152: v25.72,79.38 25.72,78.42 22.22,74.93 IC5.28
DB'4  (via drill 0.3)
  Top 0.152: IC13.15 v25.09,78.75 v25.08,78.74
  Bottom 0.152: v25.09,78.75 25.09,78.43 19.68,73.03 IC5.27
DB'5  (via drill 0.3)
  Top 0.152: IC13.16 v24.44,79.38 v24.45,79.38
  Bottom 0.152: IC5.26 17.14,71.12 24.45,78.42 v24.45,79.38
DB'6  (via drill 0.3)
  Top 0.152: IC13.17 23.79,78.76 v23.81,78.74
  Bottom 0.152: v23.81,78.74 23.81,78.42 14.6,69.22 IC5.25
DB'7  (via drill 0.3)
  Top 0.152: IC13.18 23.14,79.41 v23.18,79.38
  Bottom 0.152: 12.38,68.58 IC5.24 13.33,68.58 23.18,78.42 v23.18,79.38
DOTCLK  (via drill 0.3)
  Top 0.152: X1.6 17.14,18.41 19.28,20.55 IC1.32 21.8,20.55 IC6.1
  other vias: 28.55,27.3
E_09
  Top 0.152: IC5.34 37.46,43.18 33.86,39.58 IC1.121
GND  (via drill 0.3, 0.36, 0.8)
  Top 1.27: X1.A v4.44,10.79 | v57.78,10.79 X1.Z
  Bottom 1.27: v4.44,10.79 X1.A | X1.Z v57.78,10.79
  other vias: 0.63,63.18 0.63,73.34 13.33,85.09 18.41,85.09 23.49,85.09 28.57,85.09 33.66,85.09 38.73,85.09 43.81,85.09 59.05,85.09 59.05,15.88 59.05,20.95 61.59,47.94 61.59,42.86 61.59,37.78 61.59,32.7 61.59,53.02 61.59,27.62 61.59,20.95 61.59,22.54 0.63,58.1 0.63,53.02 0.63,47.94 0.63,42.86 0.63,37.78 0.63,32.7 3.17,74.93 8.25,85.09 3.17,85.09 53.97,85.09 48.89,85.09 61.59,58.1 61.59,63.18 61.59,68.26 59.05,10.79 0.63,20.95 0.63,22.54 3.17,22.23 0.63,27.62 61.59,73.34 59.05,73.34 59.05,74.93 59.05,80.33 0.63,68.26 3.17,73.34 3.17,15.88 3.17,10.79 11.43,48.9 24.77,48.26 43.81,48.26 45.72,59.69 33.02,48.26 3.17,80.01 34.92,28.57 20.64,37.78 22.22,36.2 41.59,37.78 41.59,16.83 20.64,16.83 5.71,80.33 13.33,80.33 20.95,77.47 27.94,76.52 27.94,73.34 40,18.41 22.22,18.41
  pour Top (rank 2): 59.69,85.72 59.69,73.98 62.23,73.98 62.23,20.32 59.69,20.32 59.69,10.16 2.54,10.16 2.54,20.32 0,20.32 0,73.98 2.54,73.98 2.54,85.72
  pour Bottom (rank 2): 59.69,85.72 59.69,73.98 62.23,73.98 62.23,20.32 59.69,20.32 59.69,10.16 2.54,10.16 2.54,20.32 0,20.32 0,73.98 2.54,73.98 2.54,85.72
LED
  Top 0.152: LED1.A 55.24,65.41 55.24,46.99 42.81,34.55 IC1.105
LIC_09
  Top 0.152: IC5.38 47.62,48.26 38.36,39 IC1.112
N$1
  Top 0.152: LED1.K R1.1
N$4  (via drill 0.3)
  Top 0.152: IC1.38 22.86,14.9 OSC1.3
  Bottom 0.152: IC6.5 22.25,23.47 22.76,22.96 OSC1.3
  other vias: 22.76,14.79
PHI2  (via drill 0.3)
  Top 0.152: IC1.30 19.65,21.55 15.24,17.14 v15.24,10.79
  Bottom 0.152: v15.24,10.79 14.6,10.16 X1.E
Q_09
  Top 0.152: IC5.35 40,44.45 34.86,39.31 IC1.119
R/!W
  Top 0.152: IC1.28 19.7,22.55 14.6,17.46 X1.5
R/!W!_09
  Top 0.152: IC13.1 21.84,75.18 22.54,75.88 27.94,75.88 32.38,71.44 IC5.32 33.66,67.31 33.66,45.4 33.97,45.09 33.97,42.55 31.36,39.94 IC1.126
S0  (via drill 0.3)
  Top 0.152: IC1.23 22.59,25.05 v22.88,24.77
  Bottom 0.152: IC6.6 v22.88,24.77
S1  (via drill 0.3)
  Top 0.152: IC1.22 23.33,25.55 v24.11,24.77
  Bottom 0.152: v24.11,24.77 25.38,23.5 IC6.4
SW0
  Top 0.152: S1.1 58.39,77.76 53.97,73.34 53.97,46.35 42.67,35.05 IC1.106
  Bottom 0.152: R3.1 57.09,80.33 S1.1
TCK  (via drill 0.3, 0.36)
  Top 0.152: IC1.67 37.36,23.59 TCK.TP 39.37,30.48 v39.37,34.29
  Bottom 0.152: SV1.1 53.02,47.94 v39.37,34.29
  other vias: 34.92,26.04
TDI  (via drill 0.36)
  Top 0.152: IC1.63 35.36,20.52 TDI.TP
  Bottom 0.152: SV1.9 47.31,37.78 43.81,34.29 43.81,22.86 41.91,20.95 TDI.TP
  other vias: 34.92,20.95
TDO  (via drill 0.36)
  Top 0.152: IC1.122 33.36,35.22 TDO.TP
  Bottom 0.152: TDO.TP 41.27,33.66 53.02,45.4 SV1.3
  other vias: 34.92,33.66
TMS  (via drill 0.3, 0.36)
  Top 0.152: IC1.65 36.36,22.05 TMS.TP 33.66,24.77 v33.66,31.11
  Bottom 0.152: 35.56,22.86 TMS.TP | SV1.5 51.12,42.86 41.59,33.34 35.88,33.34 v33.66,31.11
  other vias: 34.92,23.5
TST0
  Top 0.152: IC1.101 43.35,32.55 44.77,33.97 54.29,33.97 SV2.1
TST1
  Top 0.152: IC1.102 43.21,33.05 44.45,34.29 56.52,34.29 SV2.2
TST2
  Top 0.152: IC1.96 43.39,30.05 44.77,31.43 54.29,31.43 SV2.3
TST3
  Top 0.152: IC1.97 43.25,30.55 44.45,31.75 56.52,31.75 SV2.4
TST4
  Top 0.152: IC1.92 43.93,28.05 44.77,28.89 54.29,28.89 SV2.5
TST5
  Top 0.152: IC1.93 43.8,28.55 44.45,29.21 56.52,29.21 SV2.6
TST6
  Top 0.152: IC1.86 43.47,25.05 44.77,26.35 54.29,26.35 SV2.7
TST7
  Top 0.152: IC1.87 43.34,25.55 44.45,26.67 56.52,26.67 SV2.8
TST8
  Top 0.152: IC1.81 43.51,22.55 44.77,23.81 54.29,23.81 SV2.9
TST9
  Top 0.152: IC1.82 43.38,23.05 44.45,24.13 56.52,24.13 SV2.10
TST10
  Top 0.152: IC1.77 44.05,20.55 44.77,21.27 54.29,21.27 SV2.11
TST11
  Top 0.152: IC1.78 43.91,21.05 44.45,21.59 56.52,21.59 SV2.12
TST12
  Top 0.152: IC1.104 42.95,34.05 44.45,35.56 SV3.1
TST13
  Top 0.152: IC1.103 43.08,33.55 44.13,34.61 49.21,34.61 SV3.2
TST14
  Top 0.152: IC1.100 43.48,32.05 44.45,33.02 SV3.3
TST15
  Top 0.152: IC1.98 43.12,31.05 44.13,32.07 49.21,32.07 SV3.4
TST16
  Top 0.152: IC1.95 43.52,29.55 44.45,30.48 SV3.5
TST17
  Top 0.152: IC1.94 43.66,29.05 44.13,29.53 49.21,29.53 SV3.6
TST18
  Top 0.152: IC1.91 44.06,27.55 44.45,27.94 SV3.7
TST19
  Top 0.152: IC1.88 43.2,26.05 44.13,26.99 49.21,26.99 SV3.8
TST20
  Top 0.152: IC1.85 43.6,24.55 44.45,25.4 SV3.9
TST21
  Top 0.152: IC1.83 43.24,23.55 44.13,24.45 49.21,24.45 SV3.10
TST22
  Top 0.152: IC1.80 43.64,22.05 44.45,22.86 SV3.11
TST23
  Top 0.152: IC1.79 43.78,21.55 44.13,21.91 49.21,21.91 SV3.12
TST24
  Top 0.152: IC1.76 44.19,20.05 44.45,20.32 SV3.13